# EAGLE design stopwatch (EAGLE 9.1.3)

## Sheet 1 of 8
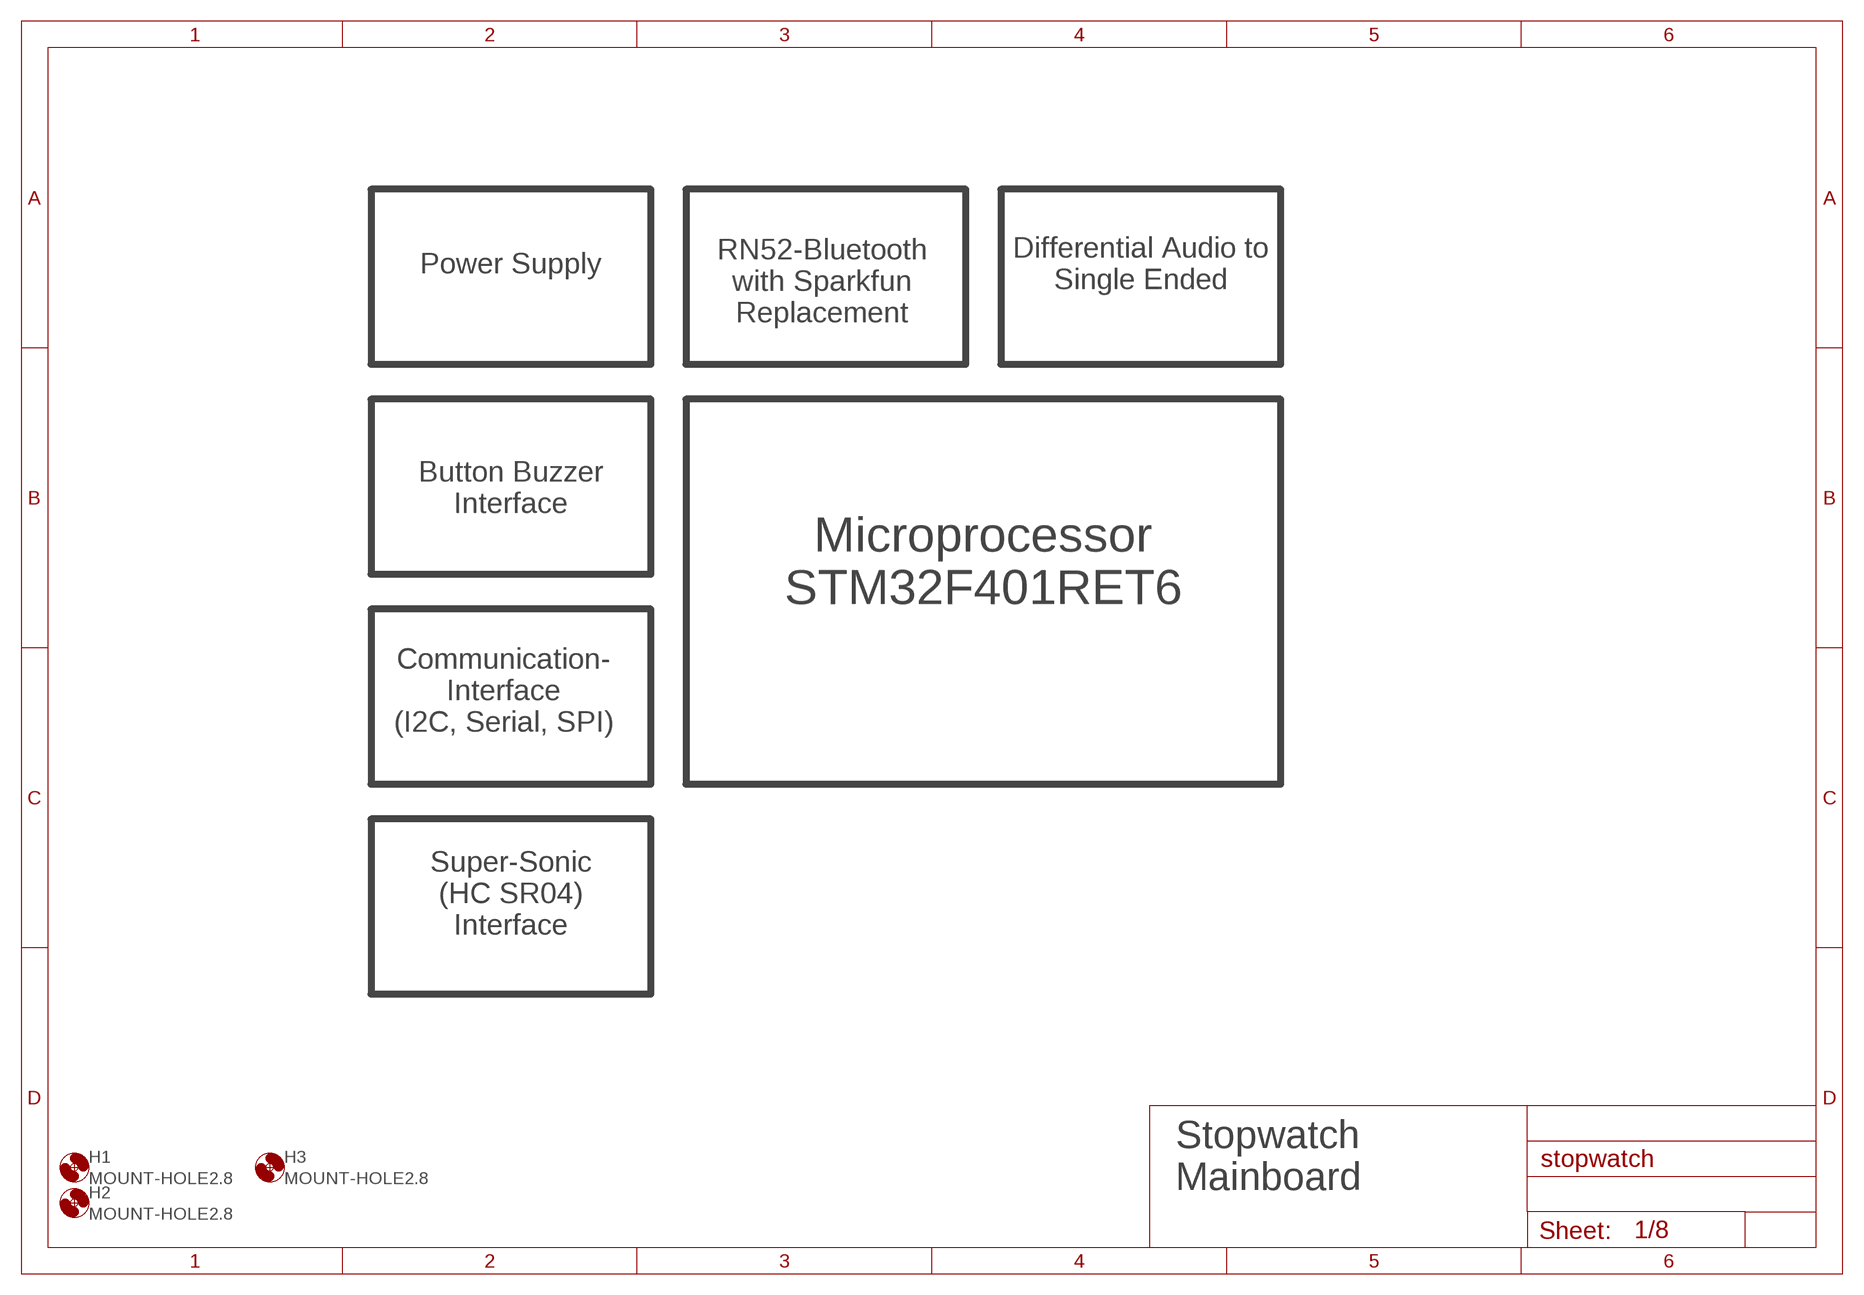
[diagram p0: schematic, sheet 1]

### Parts
H1  MOUNT-HOLE2.8  [2,8]
H2  MOUNT-HOLE2.8  [2,8]
H3  MOUNT-HOLE2.8  [2,8]

### Notes on the sheet
- Power Supply
- Differential Audio to
  Single Ended
- RN52-Bluetooth
  with Sparkfun
  Replacement
- Button Buzzer
  Interface
- Microprocessor
  STM32F401RET6
- Communication-
  Interface
  (I2C, Serial, SPI)
- Super-Sonic
  (HC SR04)
  Interface
- Stopwatch
  Mainboard

## Sheet 2 of 8
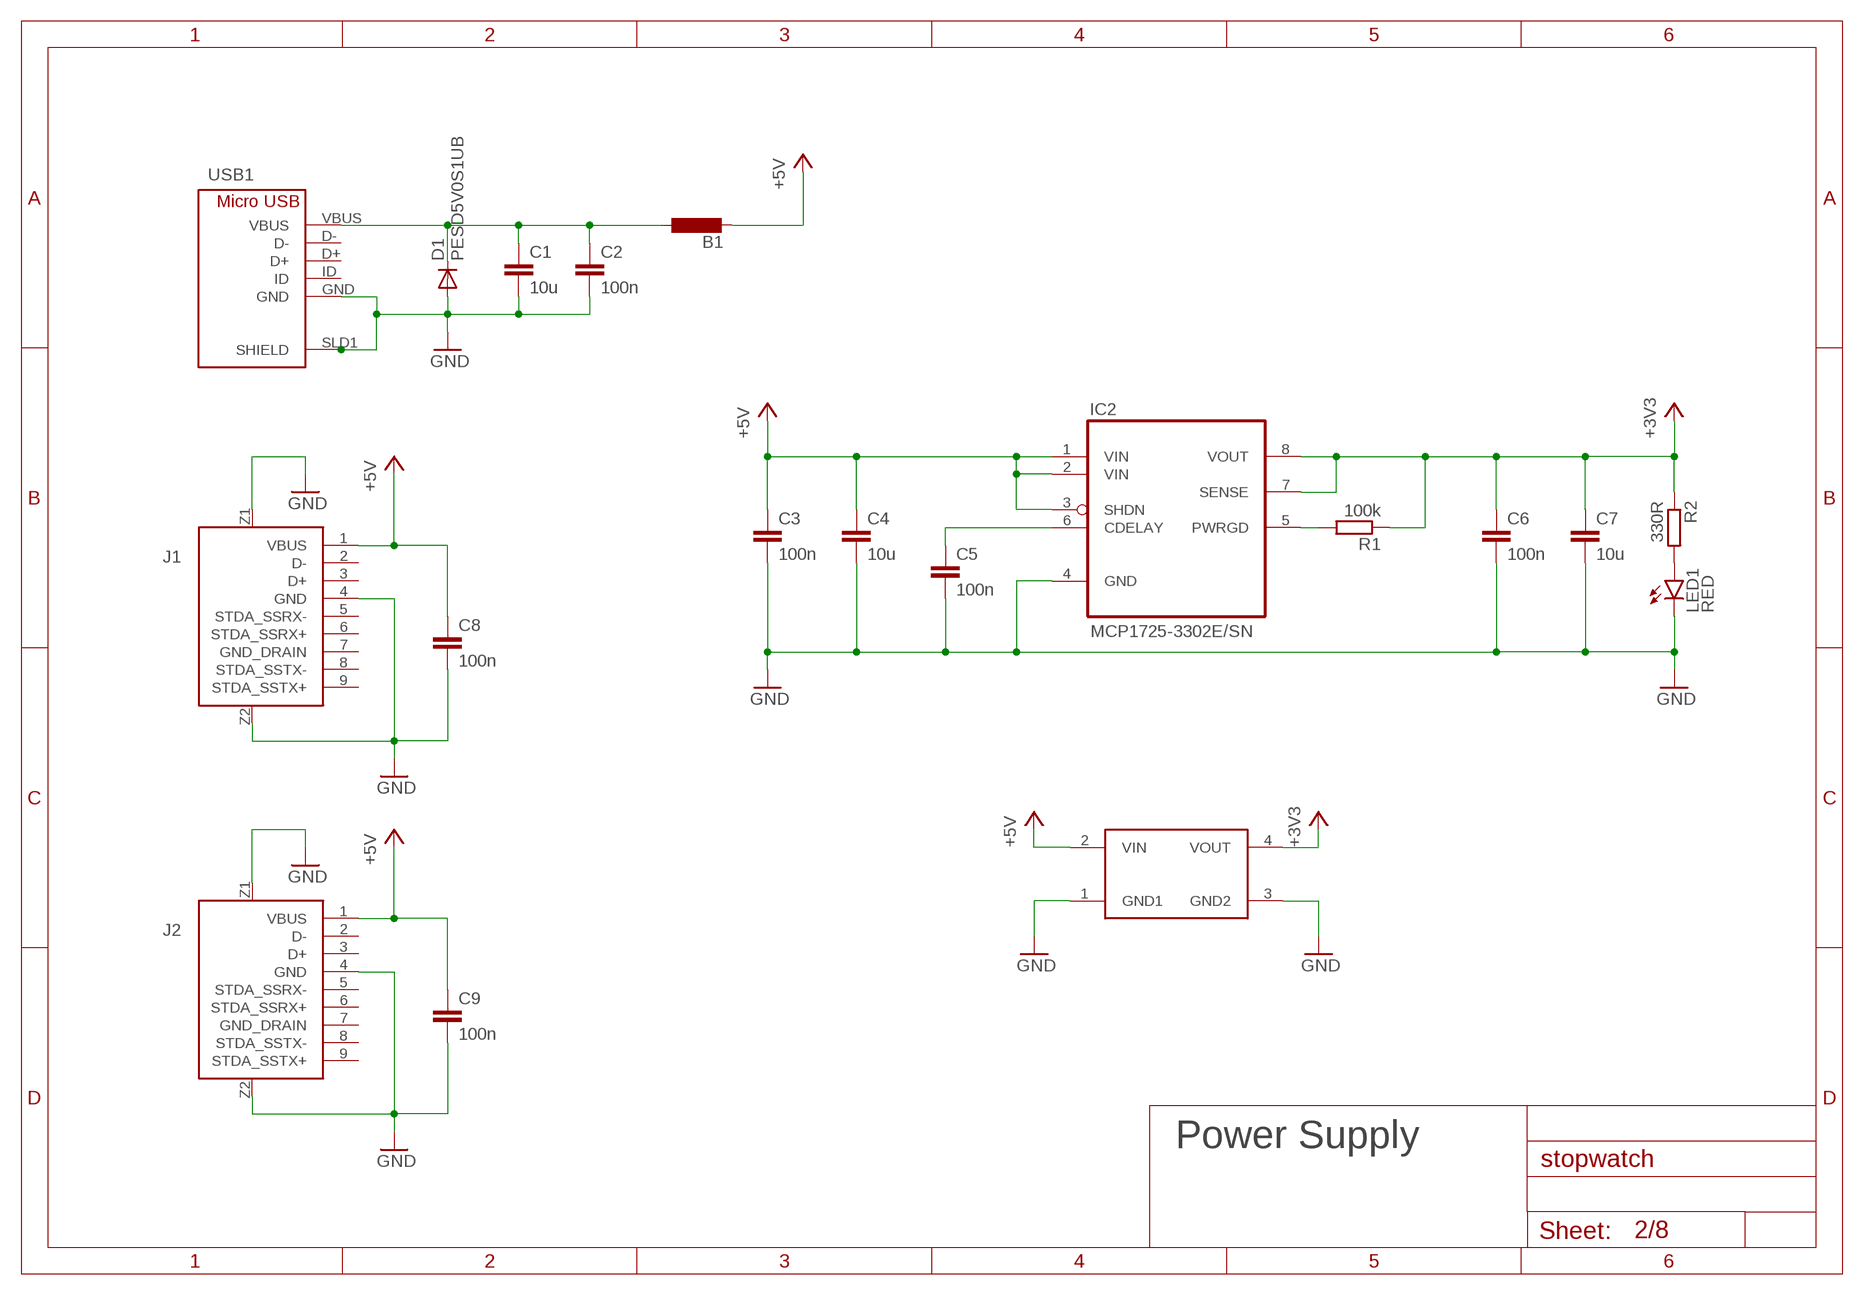
[diagram p1: schematic, sheet 2]

### Parts
B1  B-EU_B0805  [L0805]
C1  10u  C-EUC1206  [C1206]
C2  100n  C-EUC1206  [C1206]
C3  100n  C-EUC1206  [C1206]
C4  10u  C-EUC1206  [C1206]
C5  100n  C-EUC1206  [C1206]
C6  100n  C-EUC1206  [C1206]
C7  10u  C-EUC1206  [C1206]
C8  100n  C-EUC1206  [C1206]
C9  100n  C-EUC1206  [C1206]
D1  PESD5V0S1UB  DIODE-SOD523  [SOD523]
IC2  MCP1725-3302E/SN  [SOIC127P600X175-8N]
J1  USB-A3-0  [USB3_TYPE_A]
J2  USB-A3-0  [USB3_TYPE_A]
LED1  RED  LEDCHIPLED_1206  [CHIPLED_1206]
R1  100k  R-EU_R1206  [R1206]
R2  330R  R-EU_R1206  [R1206]
U$4  RC-STEP-DOWN  [RC-STEP-DOWN]
USB1  MICRO-USB  [ZX62B5PA]

### Nets
+3V3: C6.1 C7.1 IC2.7(SENSE) IC2.8(VOUT) R1.1 R2.1 U$4.4(VOUT) ; also sheet 3,4,5,6
+5V: B1.2 C3.1 C4.1 C8.1 C9.1 IC2.1(VIN) IC2.2(VIN) IC2.3(SHDN) J1.1(VBUS) J2.1(VBUS) U$4.2(VIN) ; also sheet 5,6,7,8
GND: C1.2 C2.2 C3.2 C4.2 C5.2 C6.2 C7.2 C8.2 C9.2 D1.A IC2.4(GND) J1.4(GND) J1.Z1 J1.Z2 J2.4(GND) J2.Z1 J2.Z2 LED1.C U$4.1(GND1) U$4.3(GND2) USB1.GND USB1.SLD1(SHIELD) USB1.SLD2(SHIELD2) USB1.SLD3(SHIELD3) USB1.SLD4(SHIELD4) USB1.SLD5(SHIELD5) USB1.SLD6(SHIELD6) ; also sheet 3,4,5,6,7,8
N$1: B1.1 C1.1 C2.1 D1.C USB1.VBUS
N$2: C5.1 IC2.6(CDELAY)
N$5: IC2.5(PWRGD) R1.2
N$6: LED1.A R2.2
Unconnected: J1.2(D-) J1.3(D+) J1.5(STDA_SSRX-) J1.6(STDA_SSRX+) J1.7(GND_DRAIN) J1.8(STDA_SSTX-) J1.9(STDA_SSTX+) J2.2(D-) J2.3(D+) J2.5(STDA_SSRX-) J2.6(STDA_SSRX+) J2.7(GND_DRAIN) J2.8(STDA_SSTX-) J2.9(STDA_SSTX+) USB1.D+ USB1.D- USB1.ID

### Notes on the sheet
- Power Supply

## Sheet 3 of 8
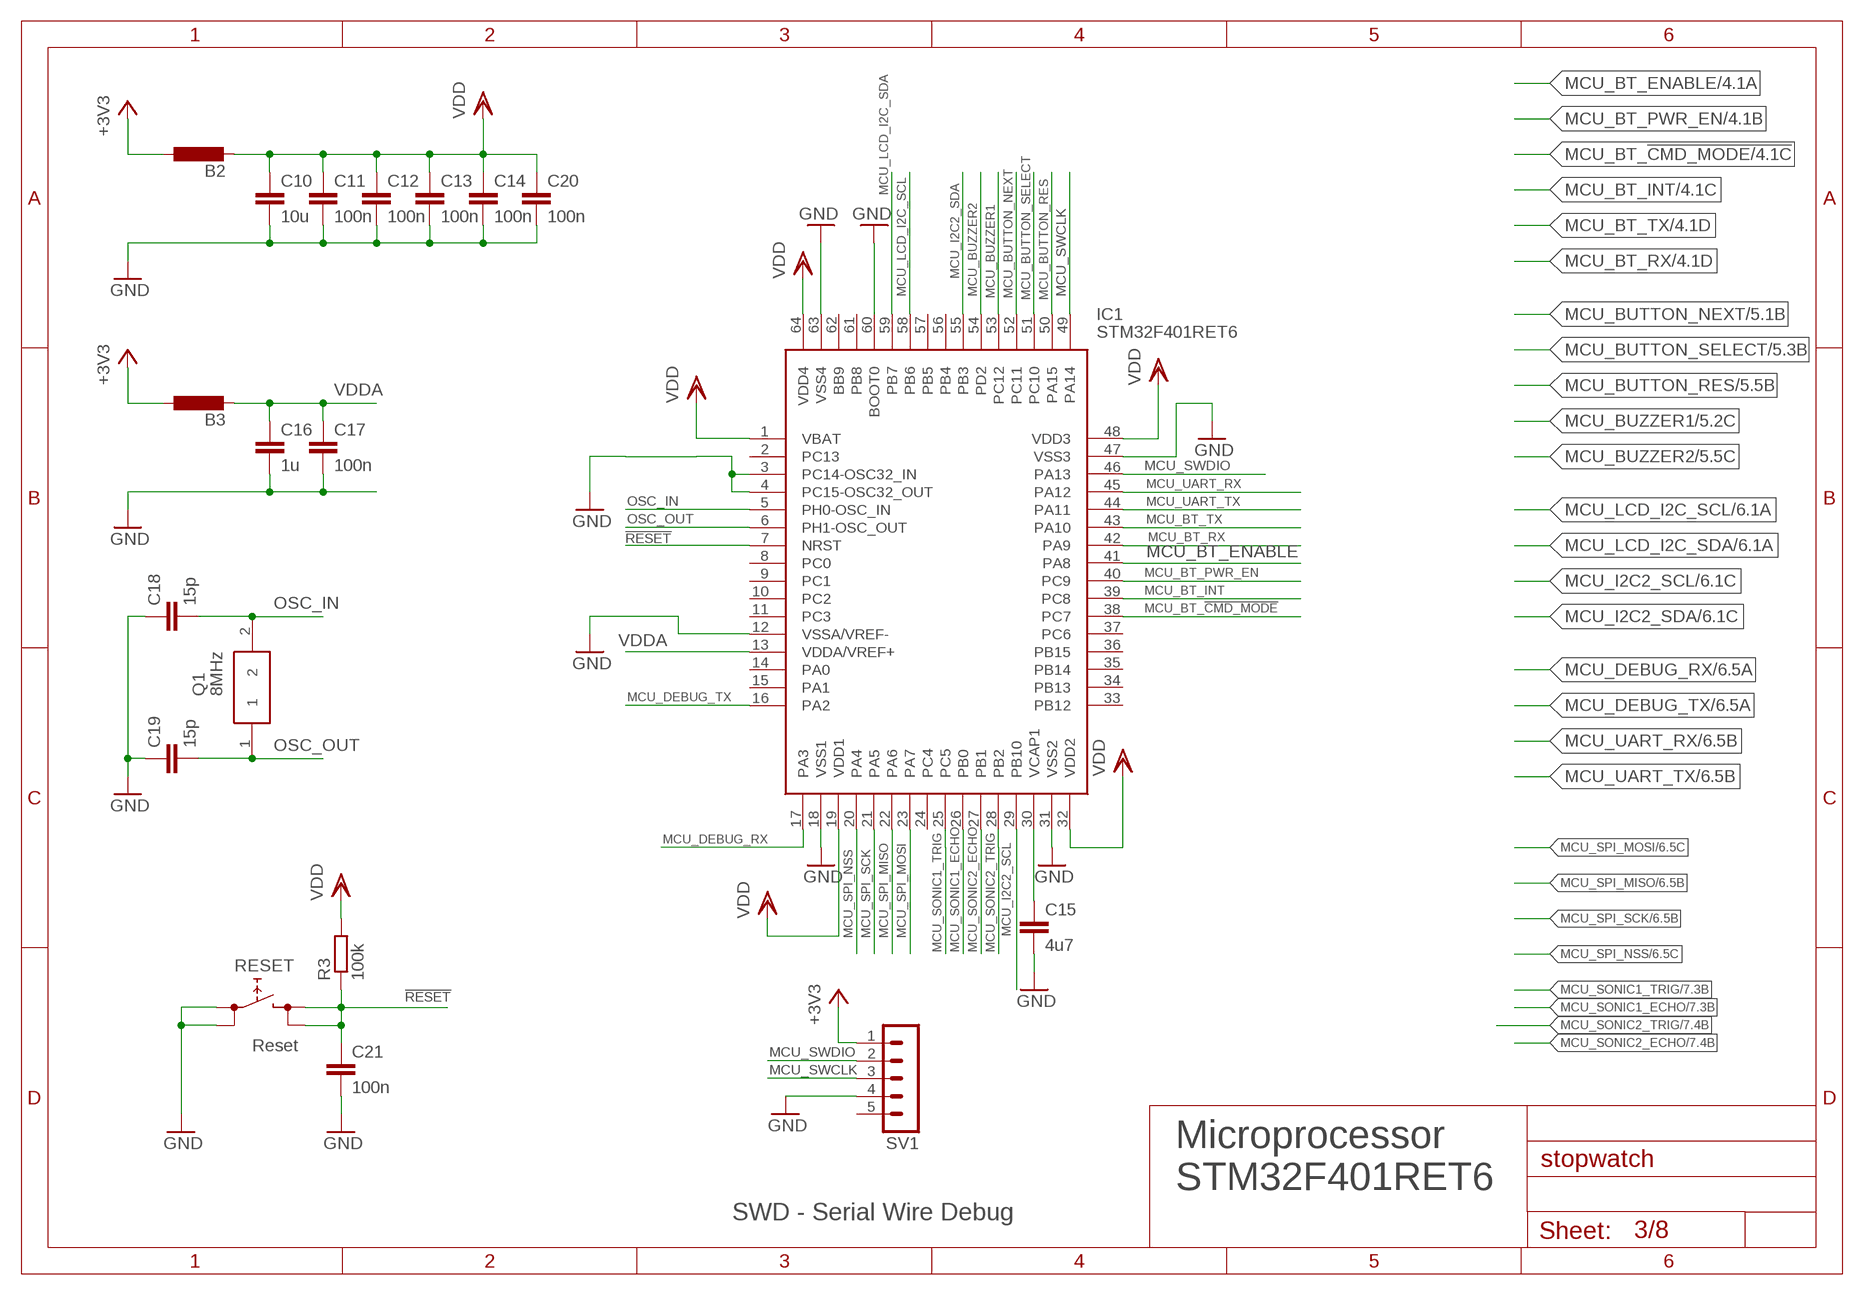
[diagram p2: schematic, sheet 3]

### Parts
B2  B-EU_B0805  [L0805]
B3  B-EU_B0805  [L0805]
C10  10u  C-EUC1206  [C1206]
C11  100n  C-EUC1206  [C1206]
C12  100n  C-EUC1206  [C1206]
C13  100n  C-EUC1206  [C1206]
C14  100n  C-EUC1206  [C1206]
C15  4u7  C-EUC1206  [C1206]
C16  1u  C-EUC1206  [C1206]
C17  100n  C-EUC1206  [C1206]
C18  15p  C-EUC1206  [C1206]
C19  15p  C-EUC1206  [C1206]
C20  100n  C-EUC1206  [C1206]
C21  100n  C-EUC1206  [C1206]
IC1  STM32F401RET6  [QFP50P1200X1200X160-64N]
Q1  8MHz  FOXSDLF_080-20  [FOXSDLF/080-20]
R3  100k  R-EU_R1206  [R1206]
RESET  Reset  TASTER_SMD  [TASTER_SMD_LSG-LSH1301XX]
SV1  MA05-1  [MA05-1]

### Nets
!RESET: C21.1 IC1.7(NRST) R3.1 RESET.3 RESET.4
+3V3: B2.1 B3.1 SV1.1 ; also sheet 2,4,5,6
GND: C10.2 C11.2 C12.2 C13.2 C14.2 C15.2 C16.2 C17.2 C18.1 C19.1 C20.2 C21.2 IC1.3(PC14-OSC32_IN) IC1.4(PC15-OSC32_OUT) IC1.12(VSSA/VREF-) IC1.18(VSS1) IC1.31(VSS2) IC1.47(VSS3) IC1.60(BOOT0) IC1.63(VSS4) RESET.1 RESET.2 SV1.4 ; also sheet 2,4,5,6,7,8
MCU_BT_!CMD_MODE: IC1.38(PC7) ; also sheet 4
MCU_BT_ENABLE: IC1.41(PA8) ; also sheet 4
MCU_BT_INT: IC1.39(PC8) ; also sheet 4
MCU_BT_PWR_EN: IC1.40(PC9) ; also sheet 4
MCU_BT_RX: IC1.42(PA9) ; also sheet 4
MCU_BT_TX: IC1.43(PA10) ; also sheet 4
MCU_BUTTON_NEXT: IC1.52(PC11) ; also sheet 5
MCU_BUTTON_RES: IC1.50(PA15) ; also sheet 5
MCU_BUTTON_SELECT: IC1.51(PC10) ; also sheet 5
MCU_BUZZER1: IC1.53(PC12) ; also sheet 5
MCU_BUZZER2: IC1.54(PD2) ; also sheet 5
MCU_DEBUG_RX: IC1.17(PA3) ; also sheet 6
MCU_DEBUG_TX: IC1.16(PA2) ; also sheet 6
MCU_I2C2_SCL: IC1.29(PB10) ; also sheet 6
MCU_I2C2_SDA: IC1.55(PB3) ; also sheet 6
MCU_LCD_I2C_SCL: IC1.58(PB6) ; also sheet 6
MCU_LCD_I2C_SDA: IC1.59(PB7) ; also sheet 6
MCU_SONIC1_ECHO: IC1.26(PB0) ; also sheet 7
MCU_SONIC1_TRIG: IC1.25(PC5) ; also sheet 7
MCU_SONIC2_ECHO: IC1.27(PB1) ; also sheet 7
MCU_SONIC2_TRIG: IC1.28(PB2) ; also sheet 7
MCU_SPI_MISO: IC1.22(PA6) ; also sheet 6
MCU_SPI_MOSI: IC1.23(PA7) ; also sheet 6
MCU_SPI_NSS: IC1.20(PA4) ; also sheet 6
MCU_SPI_SCK: IC1.21(PA5) ; also sheet 6
MCU_SWCLK: IC1.49(PA14) SV1.3
MCU_SWDIO: IC1.46(PA13) SV1.2
MCU_UART_RX: IC1.45(PA12) ; also sheet 6
MCU_UART_TX: IC1.44(PA11) ; also sheet 6
N$3: C15.1 IC1.30(VCAP1)
OSC_IN: C18.2 IC1.5(PH0-OSC_IN) Q1.2
OSC_OUT: C19.2 IC1.6(PH1-OSC_OUT) Q1.1
VDD: B2.2 C10.1 C11.1 C12.1 C13.1 C14.1 C20.1 IC1.1(VBAT) IC1.19(VDD1) IC1.32(VDD2) IC1.48(VDD3) IC1.64(VDD4) R3.2
VDDA: B3.2 C16.1 C17.1 IC1.13(VDDA/VREF+)
Unconnected: IC1.2(PC13) IC1.8(PC0) IC1.9(PC1) IC1.10(PC2) IC1.11(PC3) IC1.14(PA0) IC1.15(PA1) IC1.24(PC4) IC1.33(PB12) IC1.34(PB13) IC1.35(PB14) IC1.36(PB15) IC1.37(PC6) IC1.56(PB4) IC1.57(PB5) IC1.61(PB8) IC1.62(BB9) SV1.5

### Notes on the sheet
- Microprocessor
  STM32F401RET6
- SWD - Serial Wire Debug

## Sheet 4 of 8
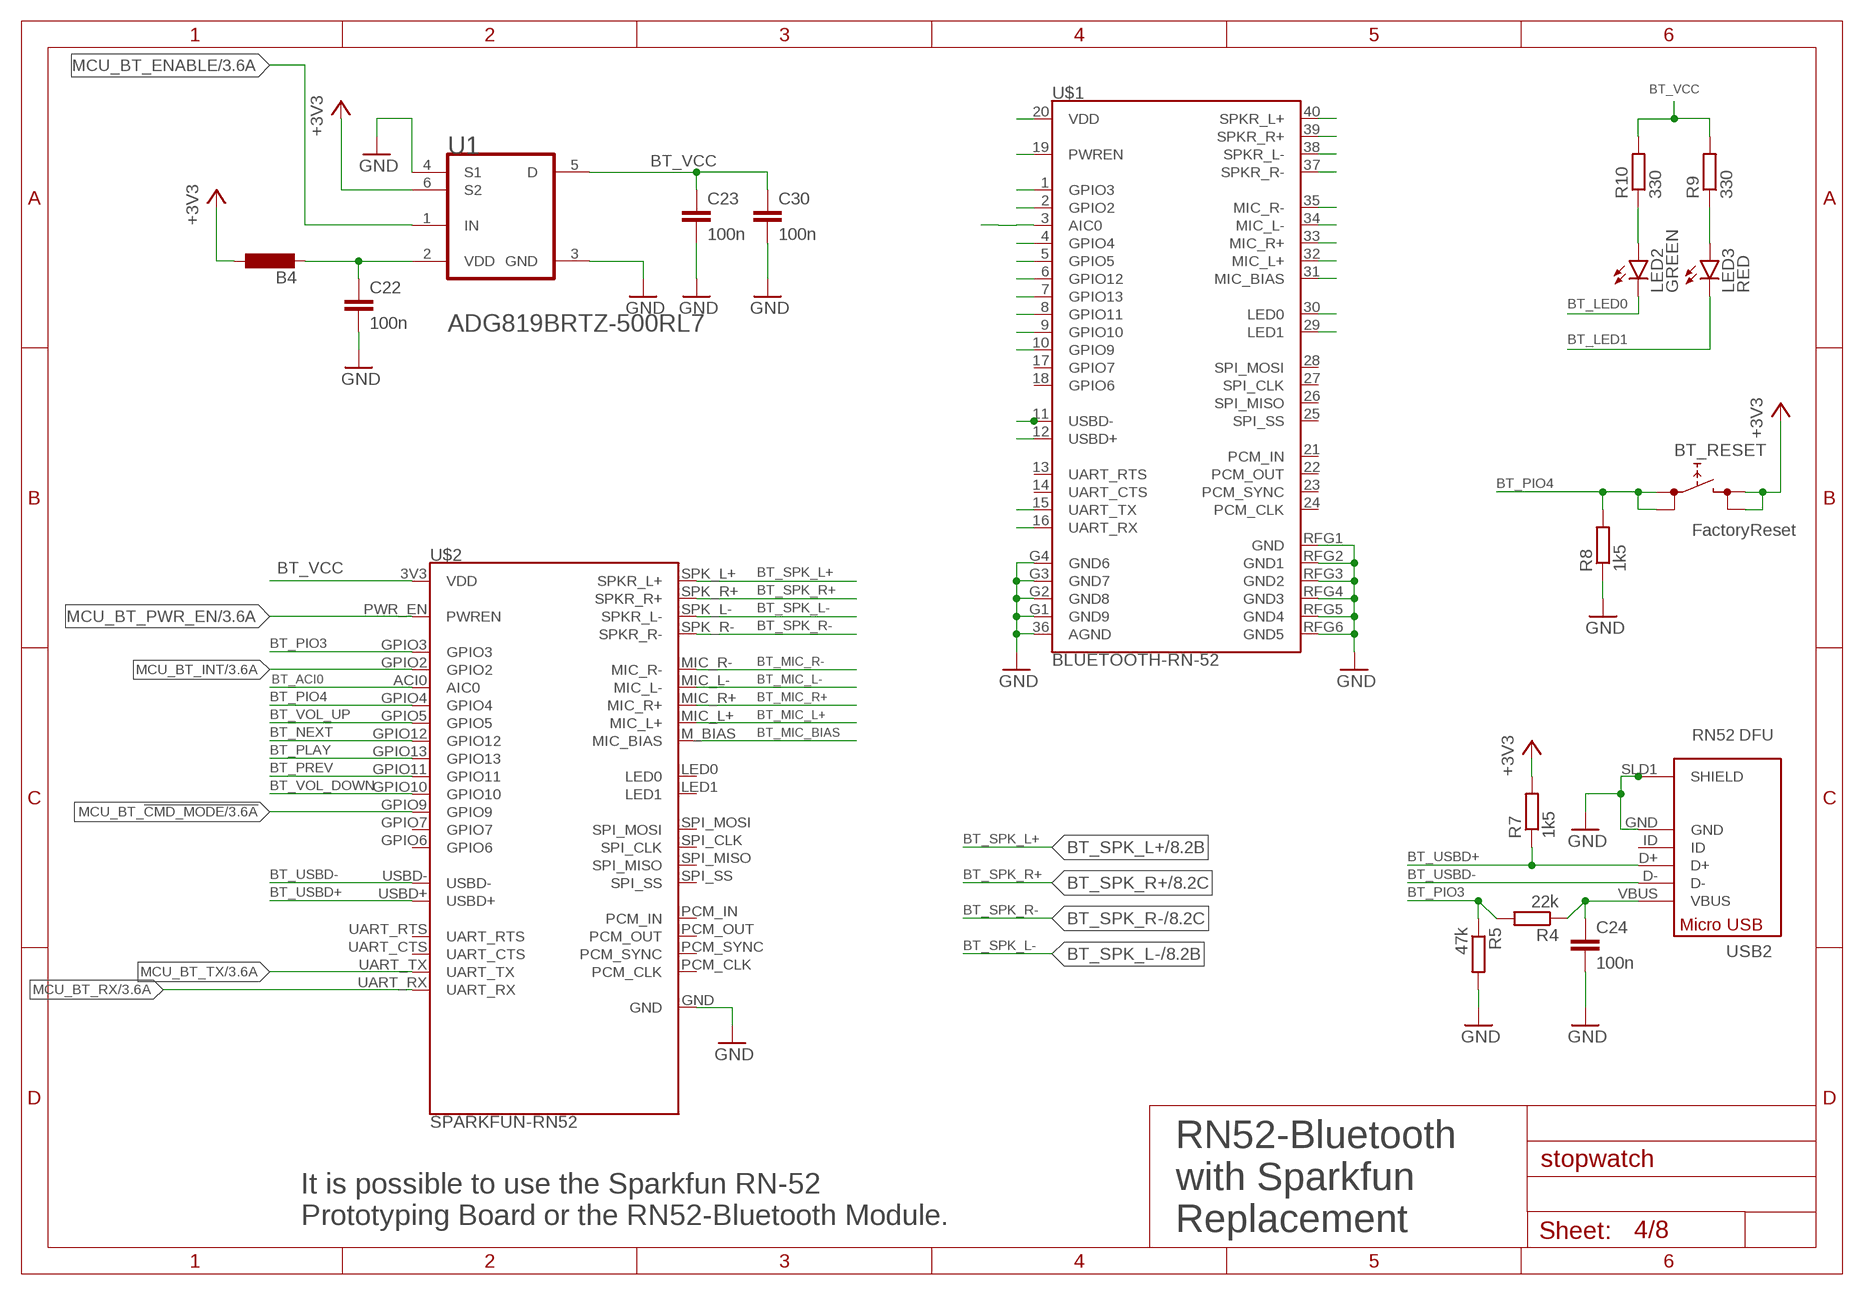
[diagram p3: schematic, sheet 4]

### Parts
B4  B-EU_B0805  [L0805]
BT_RESET  FactoryReset  TASTER_SMD  [TASTER_SMD_LSG-LSH1301XX]
C22  100n  C-EUC1206  [C1206]
C23  100n  C-EUC1206  [C1206]
C24  100n  C-EUC1206  [C1206]
C30  100n  C-EUC1206  [C1206]
LED2  GREEN  LEDCHIPLED_1206  [CHIPLED_1206]
LED3  RED  LEDCHIPLED_1206  [CHIPLED_1206]
R4  22k  R-EU_R1206  [R1206]
R5  47k  R-EU_R1206  [R1206]
R7  1k5  R-EU_R1206  [R1206]
R8  1k5  R-EU_R1206  [R1206]
R9  330  R-EU_R1206  [R1206]
R10  330  R-EU_R1206  [R1206]
U1  ANALOG_DEVICES_ADG819BRTZ-500RL7ANALOG_DEVICES_ADG819BRTZ-500RL7_0_1  [ANALOG_DEVICES_ADG819BRTZ-500RL7_1]
U$1  BLUETOOTH-RN-52  [RN-52]
U$2  SPARKFUN-RN52  [SPARKFUN-RN52]
USB2  MICRO-USB  [ZX62B5PA]

### Nets
+3V3: B4.1 BT_RESET.3 BT_RESET.4 R7.2 U1.6(S2) ; also sheet 2,3,5,6
BT_ACI0: U$1.3(AIC0) U$2.ACI0(AIC0)
BT_LED0: LED2.C U$1.30(LED0)
BT_LED1: LED3.C U$1.29(LED1)
BT_MIC_BIAS: U$1.31(MIC_BIAS) U$2.M_BIAS(MIC_BIAS)
BT_MIC_L+: U$1.32(MIC_L+) U$2.MIC_L+
BT_MIC_L-: U$1.34(MIC_L-) U$2.MIC_L-
BT_MIC_R+: U$1.33(MIC_R+) U$2.MIC_R+
BT_MIC_R-: U$1.35(MIC_R-) U$2.MIC_R-
BT_NEXT: U$1.6(GPIO12) U$2.GPIO12
BT_PIO3: R4.2 R5.1 U$1.1(GPIO3) U$2.GPIO3
BT_PIO4: BT_RESET.1 BT_RESET.2 R8.2 U$1.4(GPIO4) U$2.GPIO4
BT_PLAY: U$1.7(GPIO13) U$2.GPIO13
BT_PREV: U$1.8(GPIO11) U$2.GPIO11
BT_SPK_L+: U$1.40(SPKR_L+) U$2.SPK_L+(SPKR_L+) ; also sheet 8
BT_SPK_L-: U$1.38(SPKR_L-) U$2.SPK_L-(SPKR_L-) ; also sheet 8
BT_SPK_R+: U$1.39(SPKR_R+) U$2.SPK_R+(SPKR_R+) ; also sheet 8
BT_SPK_R-: U$1.37(SPKR_R-) U$2.SPK_R-(SPKR_R-) ; also sheet 8
BT_USBD+: R7.1 U$1.12(USBD+) U$2.USBD+ USB2.D+
BT_USBD-: U$1.11(USBD-) U$2.USBD- USB2.D-
BT_VCC: C23.1 C30.1 R9.2 R10.2 U1.5(D) U$1.20(VDD) U$2.3V3(VDD)
BT_VOL_DOWN: U$1.9(GPIO10) U$2.GPIO10
BT_VOL_UP: U$1.5(GPIO5) U$2.GPIO5
GND: C22.2 C23.2 C24.2 C30.2 R5.2 R8.1 U1.3(GND) U1.4(S1) U$1.36(AGND) U$1.G1(GND9) U$1.G2(GND8) U$1.G3(GND7) U$1.G4(GND6) U$1.RFG1(GND) U$1.RFG2(GND1) U$1.RFG3(GND2) U$1.RFG4(GND3) U$1.RFG5(GND4) U$1.RFG6(GND5) U$2.GND USB2.GND USB2.SLD1(SHIELD) USB2.SLD2(SHIELD2) USB2.SLD3(SHIELD3) USB2.SLD4(SHIELD4) USB2.SLD5(SHIELD5) USB2.SLD6(SHIELD6) ; also sheet 2,3,5,6,7,8
MCU_BT_!CMD_MODE: U$1.10(GPIO9) U$2.GPIO9 ; also sheet 3
MCU_BT_ENABLE: U1.1(IN) ; also sheet 3
MCU_BT_INT: U$1.2(GPIO2) U$2.GPIO2 ; also sheet 3
MCU_BT_PWR_EN: U$1.19(PWREN) U$2.PWR_EN(PWREN) ; also sheet 3
MCU_BT_RX: U$1.16(UART_RX) U$2.UART_RX ; also sheet 3
MCU_BT_TX: U$1.15(UART_TX) U$2.UART_TX ; also sheet 3
N$4: B4.2 C22.1 U1.2(VDD)
N$7: C24.1 R4.1 USB2.VBUS
N$11: LED2.A R10.1
N$13: LED3.A R9.1
Unconnected: U$1.13(UART_RTS) U$1.14(UART_CTS) U$1.17(GPIO7) U$1.18(GPIO6) U$1.21(PCM_IN) U$1.22(PCM_OUT) U$1.23(PCM_SYNC) U$1.24(PCM_CLK) U$1.25(SPI_SS) U$1.26(SPI_MISO) U$1.27(SPI_CLK) U$1.28(SPI_MOSI) U$2.GPIO6 U$2.GPIO7 U$2.LED0 U$2.LED1 U$2.PCM_CLK U$2.PCM_IN U$2.PCM_OUT U$2.PCM_SYNC U$2.SPI_CLK U$2.SPI_MISO U$2.SPI_MOSI U$2.SPI_SS U$2.UART_CTS U$2.UART_RTS USB2.ID

### Notes on the sheet
- RN52 DFU
- RN52-Bluetooth
  with Sparkfun
  Replacement
- It is possible to use the Sparkfun RN-52
  Prototyping Board or the RN52-Bluetooth Module.

## Sheet 5 of 8
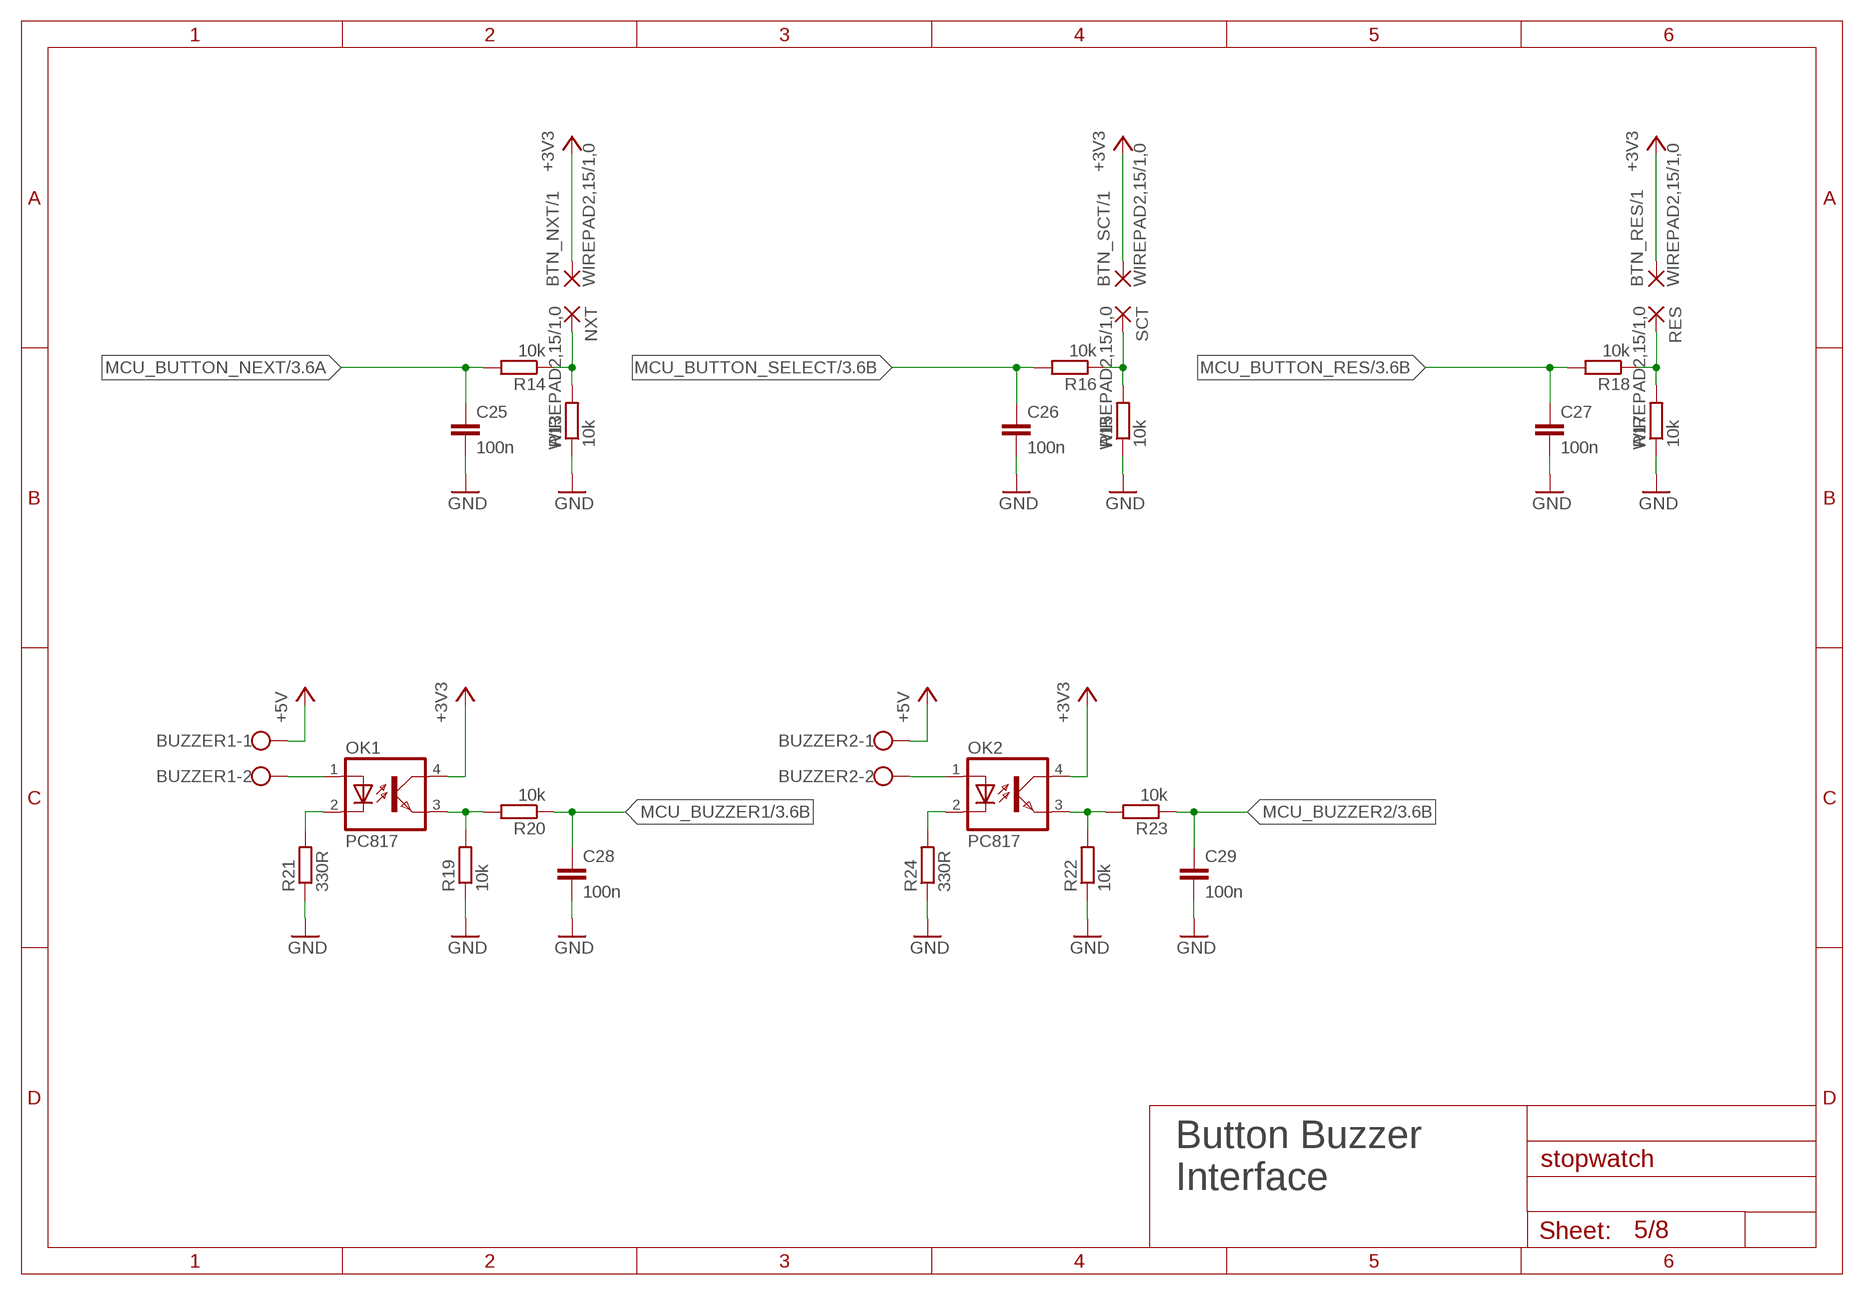
[diagram p4: schematic, sheet 5]

### Parts
BTN_NXT/1  WIREPAD2,15/1,0  [2,15/1,0]
BTN_RES/1  WIREPAD2,15/1,0  [2,15/1,0]
BTN_SCT/1  WIREPAD2,15/1,0  [2,15/1,0]
BUZZER1  W237-102  [W237-102]
BUZZER2  W237-102  [W237-102]
C25  100n  C-EUC1206  [C1206]
C26  100n  C-EUC1206  [C1206]
C27  100n  C-EUC1206  [C1206]
C28  100n  C-EUC1206  [C1206]
C29  100n  C-EUC1206  [C1206]
NXT  WIREPAD2,15/1,0  [2,15/1,0]
OK1  PC817  [DIL04]
OK2  PC817  [DIL04]
R13  10k  R-EU_R1206  [R1206]
R14  10k  R-EU_R1206  [R1206]
R15  10k  R-EU_R1206  [R1206]
R16  10k  R-EU_R1206  [R1206]
R17  10k  R-EU_R1206  [R1206]
R18  10k  R-EU_R1206  [R1206]
R19  10k  R-EU_R1206  [R1206]
R20  10k  R-EU_R1206  [R1206]
R21  330R  R-EU_R1206  [R1206]
R22  10k  R-EU_R1206  [R1206]
R23  10k  R-EU_R1206  [R1206]
R24  330R  R-EU_R1206  [R1206]
RES  WIREPAD2,15/1,0  [2,15/1,0]
SCT  WIREPAD2,15/1,0  [2,15/1,0]

### Nets
+3V3: BTN_NXT/1.1(P) BTN_RES/1.1(P) BTN_SCT/1.1(P) OK1.4(COL) OK2.4(COL) ; also sheet 2,3,4,6
+5V: BUZZER1.1 BUZZER2.1 ; also sheet 2,6,7,8
GND: C25.2 C26.2 C27.2 C28.2 C29.2 R13.1 R15.1 R17.1 R19.1 R21.1 R22.1 R24.1 ; also sheet 2,3,4,6,7,8
MCU_BUTTON_NEXT: C25.1 R14.2 ; also sheet 3
MCU_BUTTON_RES: C27.1 R18.2 ; also sheet 3
MCU_BUTTON_SELECT: C26.1 R16.2 ; also sheet 3
MCU_BUZZER1: C28.1 R20.1 ; also sheet 3
MCU_BUZZER2: C29.1 R23.1 ; also sheet 3
N$9: NXT.1(P) R13.2 R14.1
N$10: R15.2 R16.1 SCT.1(P)
N$14: R17.2 R18.1 RES.1(P)
N$15: BUZZER1.2 OK1.1(A)
N$16: OK1.2(C) R21.2
N$17: OK1.3(EMIT) R19.2 R20.2
N$18: BUZZER2.2 OK2.1(A)
N$19: OK2.2(C) R24.2
N$20: OK2.3(EMIT) R22.2 R23.2

### Notes on the sheet
- Button Buzzer
  Interface

## Sheet 6 of 8
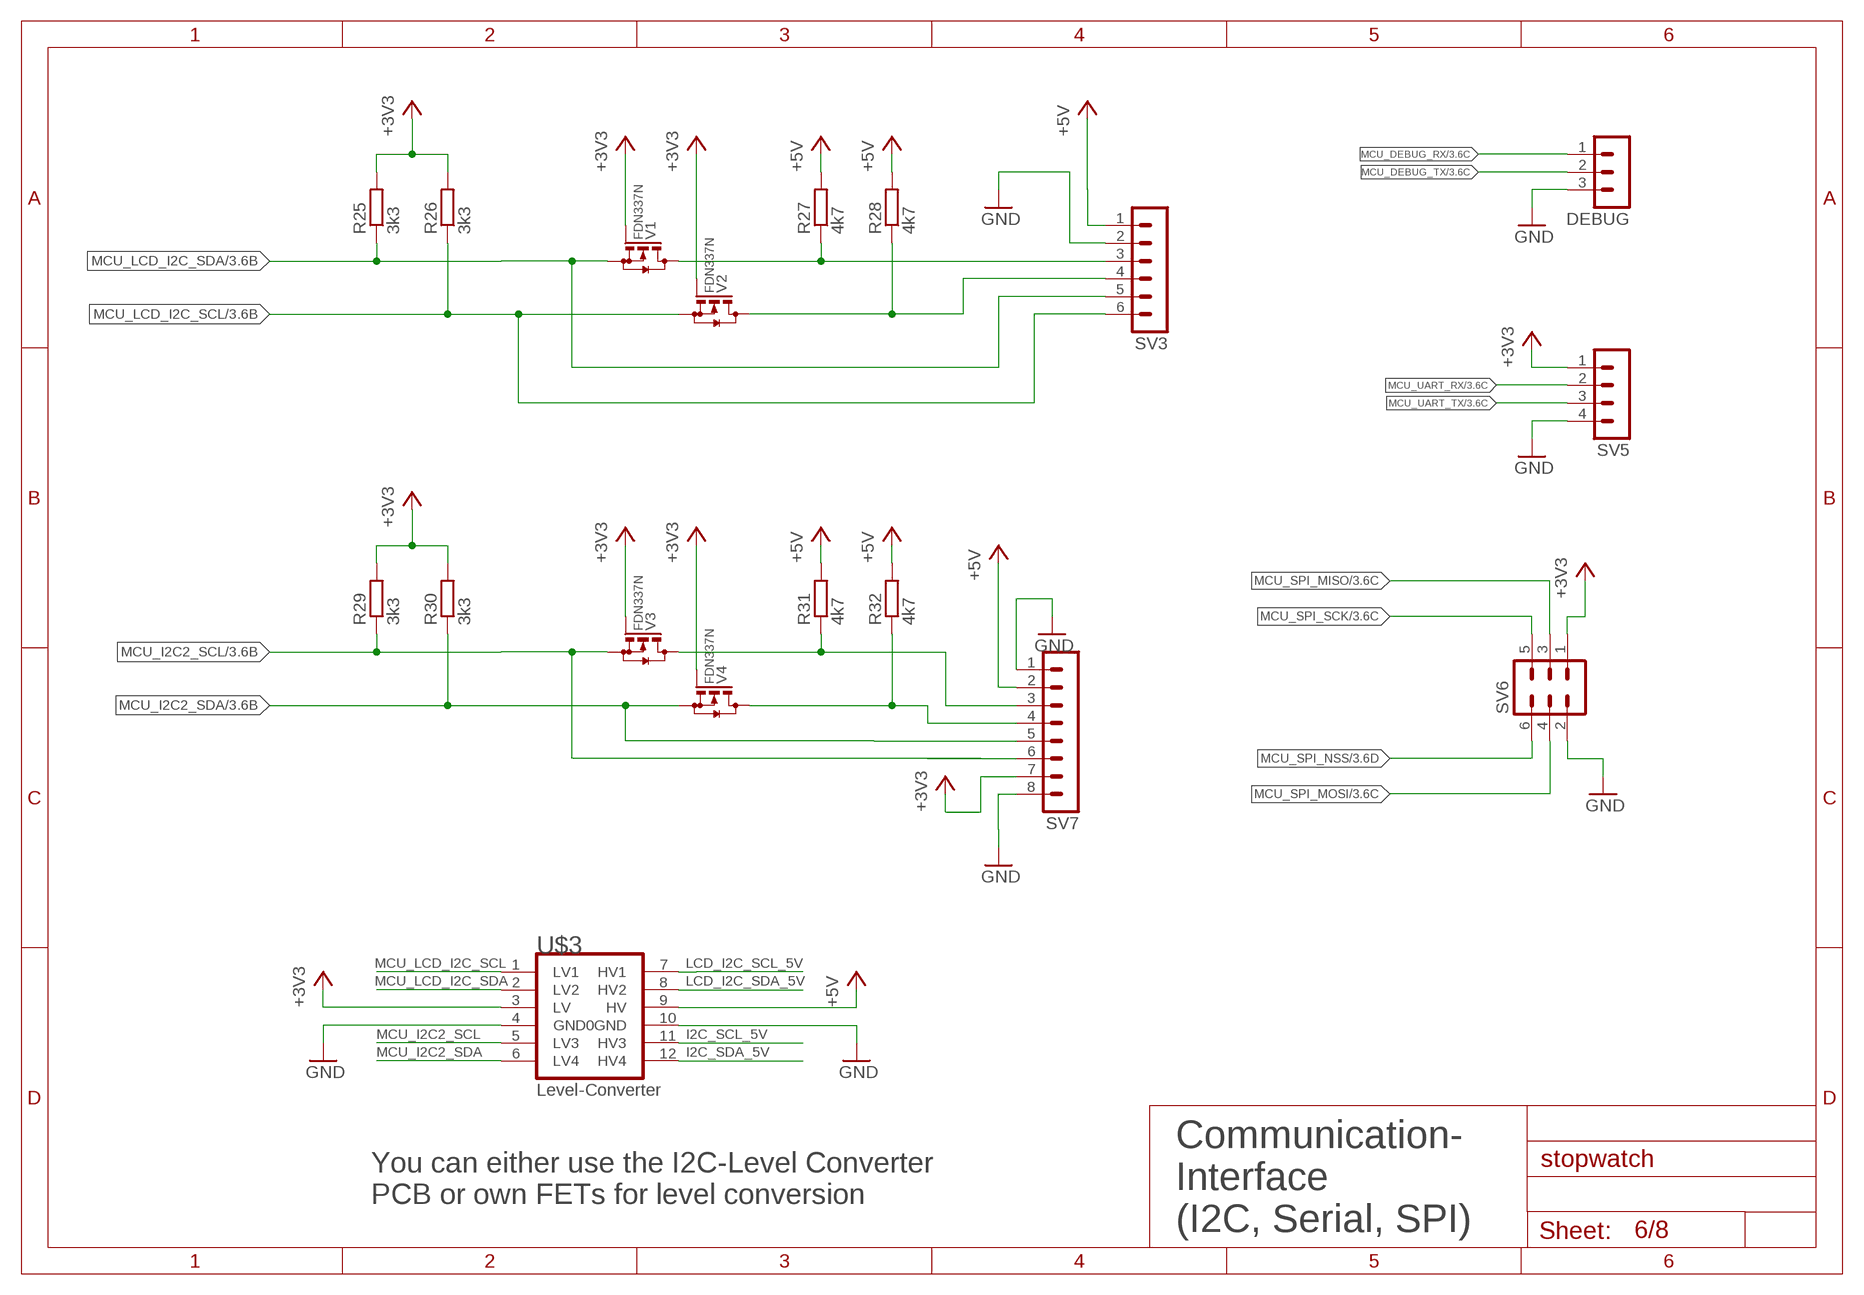
[diagram p5: schematic, sheet 6]

### Parts
DEBUG  MA03-1  [MA03-1]
R25  3k3  R-EU_R1206  [R1206]
R26  3k3  R-EU_R1206  [R1206]
R27  4k7  R-EU_R1206  [R1206]
R28  4k7  R-EU_R1206  [R1206]
R29  3k3  R-EU_R1206  [R1206]
R30  3k3  R-EU_R1206  [R1206]
R31  4k7  R-EU_R1206  [R1206]
R32  4k7  R-EU_R1206  [R1206]
SV3  MA06-1  [MA06-1]
SV5  MA04-1  [MA04-1]
SV6  MA03-2  [MA03-2]
SV7  MA08-1  [MA08-1]
U$3  I2C-LEVELCONVERTER-PCB  [I2C-LEVELCONVERTER-PCB]
V1  FDN337N  [SOT23]
V2  FDN337N  [SOT23]
V3  FDN337N  [SOT23]
V4  FDN337N  [SOT23]

### Nets
+3V3: R25.2 R26.2 R29.2 R30.2 SV5.1 SV6.1 SV7.7 U$3.3(LV) V1.1(G) V2.1(G) V3.1(G) V4.1(G) ; also sheet 2,3,4,5
+5V: R27.2 R28.2 R31.2 R32.2 SV3.1 SV7.2 U$3.9(HV) ; also sheet 2,5,7,8
GND: DEBUG.3 SV3.2 SV5.4 SV6.2 SV7.1 SV7.8 U$3.4(GND0) U$3.10(GND) ; also sheet 2,3,4,5,7,8
I2C_SCL_5V: R31.1 SV7.3 U$3.11(HV3) V3.3(D)
I2C_SDA_5V: R32.1 SV7.4 U$3.12(HV4) V4.3(D)
LCD_I2C_SCL_5V: R28.1 SV3.4 U$3.7(HV1) V2.3(D)
LCD_I2C_SDA_5V: R27.1 SV3.3 U$3.8(HV2) V1.3(D)
MCU_DEBUG_RX: DEBUG.1 ; also sheet 3
MCU_DEBUG_TX: DEBUG.2 ; also sheet 3
MCU_I2C2_SCL: R29.1 SV7.6 U$3.5(LV3) V3.2(S) ; also sheet 3
MCU_I2C2_SDA: R30.1 SV7.5 U$3.6(LV4) V4.2(S) ; also sheet 3
MCU_LCD_I2C_SCL: R26.1 SV3.6 U$3.1(LV1) V2.2(S) ; also sheet 3
MCU_LCD_I2C_SDA: R25.1 SV3.5 U$3.2(LV2) V1.2(S) ; also sheet 3
MCU_SPI_MISO: SV6.3 ; also sheet 3
MCU_SPI_MOSI: SV6.4 ; also sheet 3
MCU_SPI_NSS: SV6.6 ; also sheet 3
MCU_SPI_SCK: SV6.5 ; also sheet 3
MCU_UART_RX: SV5.2 ; also sheet 3
MCU_UART_TX: SV5.3 ; also sheet 3

### Notes on the sheet
- Communication-
  Interface
  (I2C, Serial, SPI)
- You can either use the I2C-Level Converter
  PCB or own FETs for level conversion

## Sheet 7 of 8
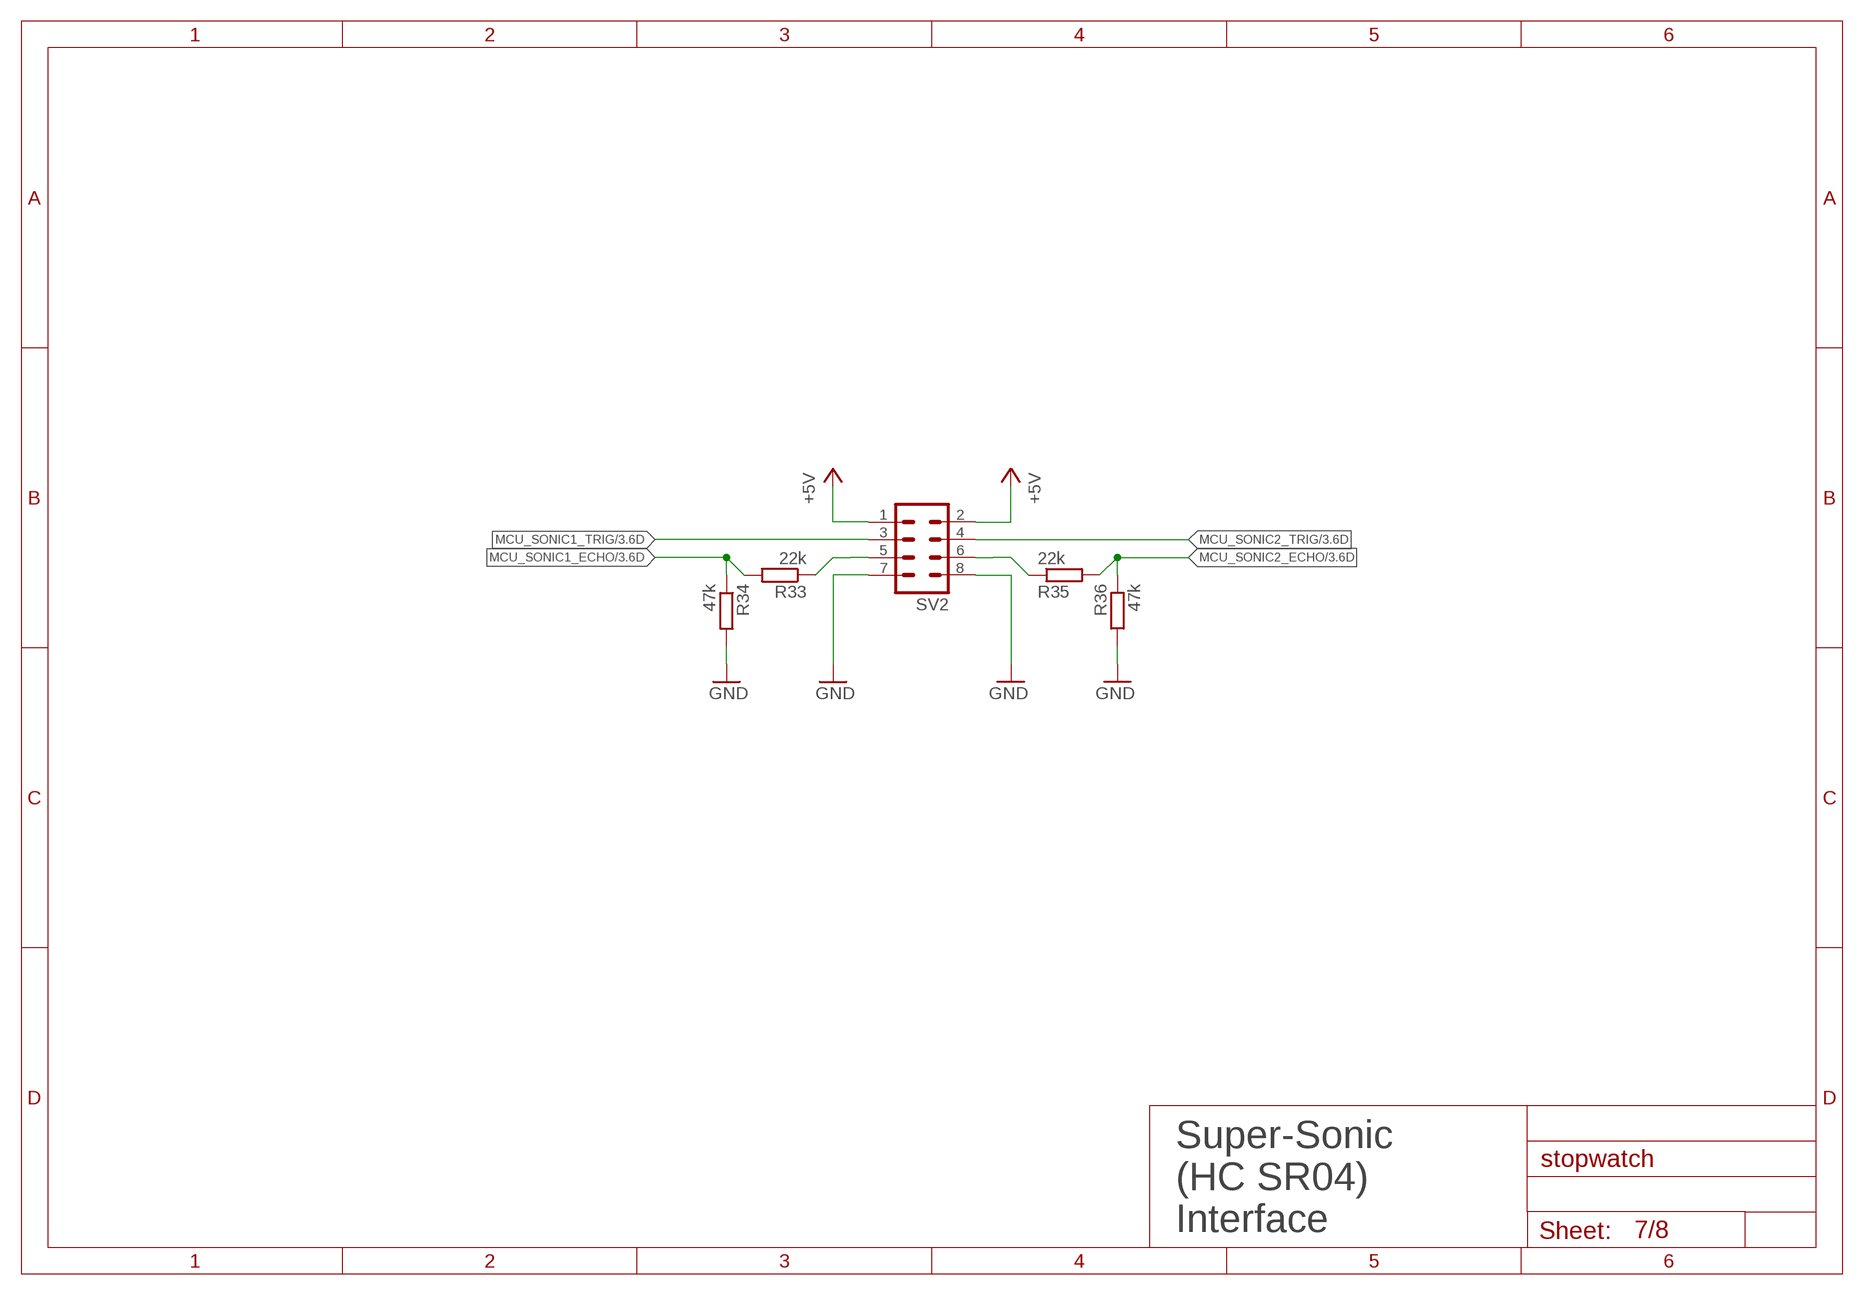
[diagram p6: schematic, sheet 7]

### Parts
R33  22k  R-EU_R1206  [R1206]
R34  47k  R-EU_R1206  [R1206]
R35  22k  R-EU_R1206  [R1206]
R36  47k  R-EU_R1206  [R1206]
SV2  MA04-2  [MA04-2]

### Nets
+5V: SV2.1 SV2.2 ; also sheet 2,5,6,8
GND: R34.2 R36.2 SV2.7 SV2.8 ; also sheet 2,3,4,5,6,8
MCU_SONIC1_ECHO: R33.2 R34.1 ; also sheet 3
MCU_SONIC1_TRIG: SV2.3 ; also sheet 3
MCU_SONIC2_ECHO: R35.2 R36.1 ; also sheet 3
MCU_SONIC2_TRIG: SV2.4 ; also sheet 3
N$21: R35.1 SV2.6
N$22: R33.1 SV2.5

### Notes on the sheet
- Super-Sonic
  (HC SR04)
  Interface

## Sheet 8 of 8
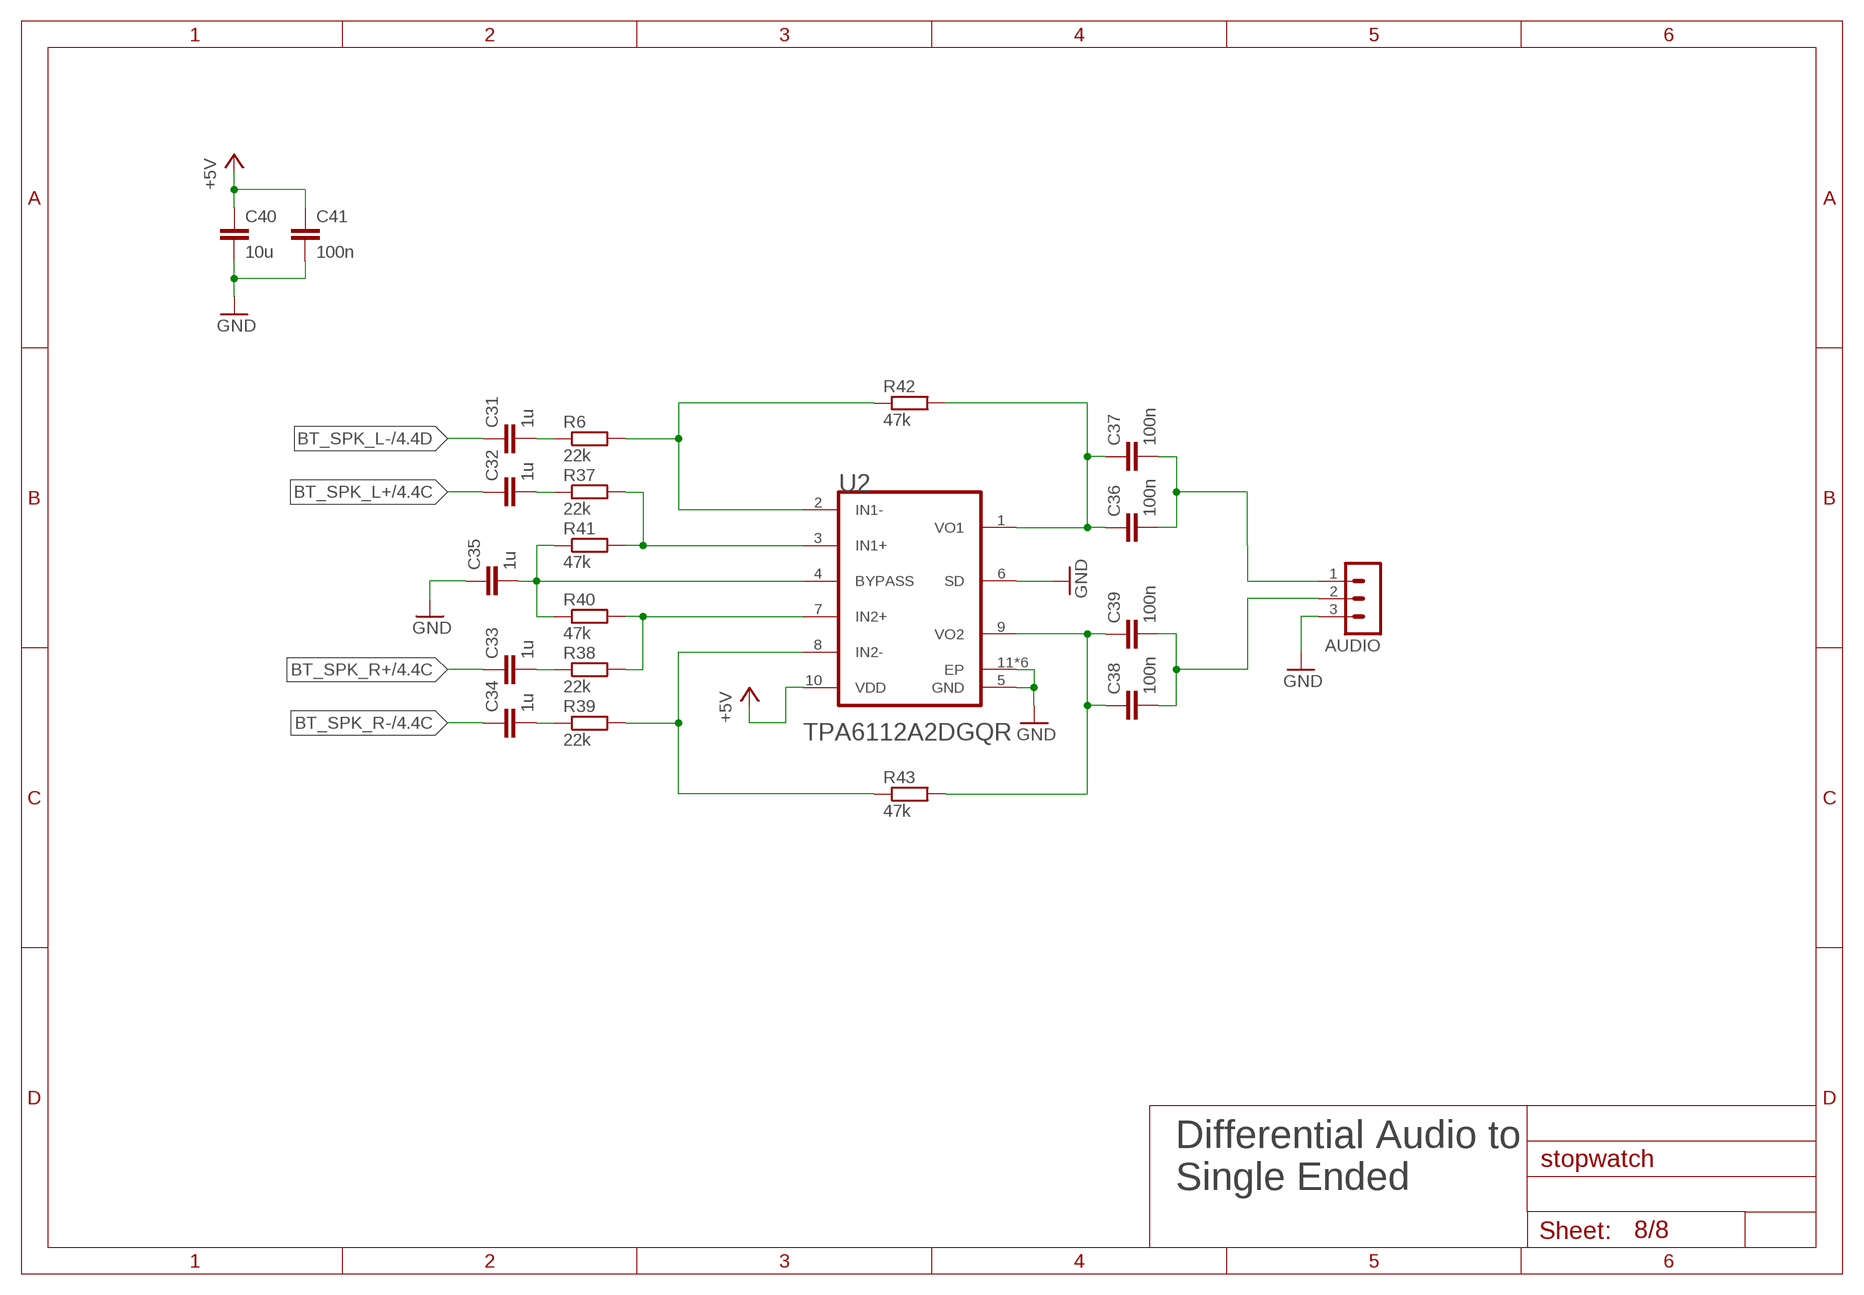
[diagram p7: schematic, sheet 8]

### Parts
AUDIO  MA03-1  [MA03-1]
C31  1u  C-EUC1206  [C1206]
C32  1u  C-EUC1206  [C1206]
C33  1u  C-EUC1206  [C1206]
C34  1u  C-EUC1206  [C1206]
C35  1u  C-EUC1206  [C1206]
C36  100n  C-EUC1206  [C1206]
C37  100n  C-EUC1206  [C1206]
C38  100n  C-EUC1206  [C1206]
C39  100n  C-EUC1206  [C1206]
C40  10u  C-EUC1206  [C1206]
C41  100n  C-EUC1206  [C1206]
R6  22k  R-EU_R1206  [R1206]
R37  22k  R-EU_R1206  [R1206]
R38  22k  R-EU_R1206  [R1206]
R39  22k  R-EU_R1206  [R1206]
R40  47k  R-EU_R1206  [R1206]
R41  47k  R-EU_R1206  [R1206]
R42  47k  R-EU_R1206  [R1206]
R43  47k  R-EU_R1206  [R1206]
U2  TEXAS_INSTRUMENTS_TPA6112A2DGQRTEXAS_INSTRUMENTS_TPA6112A2DGQR_0_1  [TEXAS_INSTRUMENTS_TPA6112A2DGQR_1]

### Nets
+5V: C40.1 C41.1 U2.10(VDD) ; also sheet 2,5,6,7
BT_SPK_L+: C32.1 ; also sheet 4
BT_SPK_L-: C31.1 ; also sheet 4
BT_SPK_R+: C33.1 ; also sheet 4
BT_SPK_R-: C34.1 ; also sheet 4
GND: AUDIO.3 C35.1 C40.2 C41.2 U2.5(GND) U2.6(SD) U2.11(EP) U2.PAD_1(EP) U2.PAD_2(EP) U2.PAD_3(EP) U2.PAD_4(EP) U2.PAD_5(EP) ; also sheet 2,3,4,5,6,7
N$12: R6.2 R42.1 U2.2(IN1-)
N$23: R39.2 R43.1 U2.8(IN2-)
N$25: AUDIO.2 C38.2 C39.2
N$26: C38.1 C39.1 R43.2 U2.9(VO2)
N$27: C36.1 C37.1 R42.2 U2.1(VO1)
N$30: C31.2 R6.1
N$31: C32.2 R37.1
N$32: C33.2 R38.1
N$33: C34.2 R39.1
N$34: R37.2 R41.2 U2.3(IN1+)
N$35: R38.2 R40.2 U2.7(IN2+)
N$36: C35.2 R40.1 R41.1 U2.4(BYPASS)
N$37: AUDIO.1 C36.2 C37.2

### Notes on the sheet
- Differential Audio to
  Single Ended

## Library data of the parts
AUDIO DEBUG = con-lstb:MA03-1: PIN HEADER; OC_FARNELL: unknown; OC_NEWARK: unknown
B1-B4 = stopwatch:B-EU_: EMI Filter
BT_RESET RESET = stopwatch:TASTER_SMD: 6.0 X 6.0mm TACT Switch (SMD) - Schurter Typ LSG/LSH 1301.xx Source: http://www.reichelt.de/TASTER-9315/3/index.html?&ACTION=3&LA=446&ARTICLE=44514&artnr=TASTER+9315&SEARCH=taster+931
BTN_NXT/1 BTN_RES/1 BTN_SCT/1 NXT RES SCT = wirepad:WIREPAD: Wire PAD connect wire on PCB
BUZZER1 BUZZER2 = con-wago-500:W237-102: WAGO SCREW CLAMP; MPN: 237-102; OC_FARNELL: unknown; OC_NEWARK: 70K9898
C1-C41 = rcl:C-EU: CAPACITOR, European symbol; SPICEPREFIX: C
D1 = diode:DIODE-: DIODE
H1-H3 = holes:MOUNT-HOLE: MOUNTING HOLE with drill center marker
IC1 = stopwatch:STM32F401RET6: ARM Cortex-M4 32b MCU+FPU Source: Datasheet <http://uk.rs-online.com/web/p/products/1661154>; DESCRIPTION: ARM Cortex-M4 32b MCU+FPU; HEIGHT: 1.6mm; MANUFACTURER_NAME: STMicroelectronics; MANUFACTURER_PART_NUMBER: STM32F401RET6; RS_PART_NUMBER: 1661154
IC2 = stopwatch:MCP1725-3302E/SN: Low Quiescent Current LDO Regulator; MPN: MCP1725-3302E/SN; OC_FARNELL: 1439383; OC_NEWARK: 58M8879; PACKAGE: SOIC-8; SUPPLIER: Microchip
J1 J2 = stopwatch:USB-A3-0: WR-COM USB 3.0 HORIZONTAL TYPE A=>Code : Con_I-O_COM_USB-3.0_A_629121030100 <http://katalog.we-online.de/media/images/eican/Con_I-O_COM_USB-3.0_A_629121030100_pf2.jpg> Details see: http://katalog.we-online.de/en/em/692_121_030_100 Created 2014-07-09, Karrer Zheng 2014 (C) Würth Elektronik
LED1-LED3 = led:LED: LED OSRAM: - CHIPLED LG R971, LG N971, LY N971, LG Q971, LY Q971, LO R971, LY R971 LH N974, LH R974 LS Q976, LO Q976, LY Q976 LO Q996 - Hyper CHIPLED LW Q18S LB Q993, LB Q99A, LB R99A - SideLED LS A670, LO A670, LY A670, LG A670, LP A670 LB A673, LV A673, LT A673, LW A673 LH A674 LY A675 LS A676, LA A676, LO A676, LY A676, LW A676 LS A679, LY A679, LG A679 - Hyper Micro SIDELED® LS Y876, LA Y876, LO Y876, LY Y876 LT Y87S - SmartLED LW L88C, LW L88S LB L89C, LB L89S, LG L890 LS L89K, LO L89K, LY L89K LS L896, LA L896, LO L896, LY L896 - TOPLED LS T670, LO T670, LY T670, LG T670, LP T670 LSG T670, LSP T670, LSY T670, LOP T670, LYG T670 LG T671, LOG T671, LSG T671 LB T673, LV T673, LT T673, LW T673 LH T674 LS T676, LA T676, LO T676, LY T676, LB T676, LH T676, LSB T676, LW T676 LB T67C, LV T67C, LT T67C, LS T67K, LO T67K, LY T67K, LW E67C LS E67B, LA E67B, LO E67B, LY E67B, LB E67C, LV E67C, LT E67C LW T67C LS T679, LY T679, LG T679 LS T770, LO T770, LY T770, LG T770, LP T770 LB T773, LV T773, LT T773, LW T773 LH T774 LS E675, LA E675, LY E675, LS T675 LS T776, LA T776, LO T776, LY T776, LB T776 LHGB T686 LT T68C, LB T68C - Hyper Mini TOPLED® LB M676 - Mini TOPLED Santana® LG M470 LS M47K, LO M47K, LY M47K Source: http://www.osram.convergy.de LUXEON: - LUMILED® LXK2-PW12-R00, LXK2-PW12-S00, LXK2-PW14-U00, LXK2-PW14-V00 LXK2-PM12-R00, LXK2-PM12-S00, LXK2-PM14-U00 LXK2-PE12-Q00, LXK2-PE12-R00, LXK2-PE12-S00, LXK2-PE14-T00, LXK2-PE14-U00 LXK2-PB12-K00, LXK2-PB12-L00, LXK2-PB12-M00, LXK2-PB14-N00, LXK2-PB14-P00, LXK2-PB14-Q00 LXK2-PR12-L00, LXK2-PR12-M00, LXK2-PR14-Q00, LXK2-PR14-R00 LXK2-PD12-Q00, LXK2-PD12-R00, LXK2-PD12-S00 LXK2-PH12-R00, LXK2-PH12-S00 LXK2-PL12-P00, LXK2-PL12-Q00, LXK2-PL12-R00 Source: www.luxeon.com KINGBRIGHT: KA-3528ASYC Source: www.kingbright.com
OK1 OK2 = optocoupler:PC817: SHARP OPTO COUPLER; MPN: PC817X4J000F; OC_FARNELL: 9707727; OC_NEWARK: 97K7059
Q1 = stopwatch:FOXSDLF_080-20: Crystal SMD 8.000MHz HC49S-SMD Crystal 8MHz, 30ppm, 2-Pin SMD, 11.7 x 5 x 4.5mm Source: Datasheet <http://uk.rs-online.com/web/p/products/1734329>; DESCRIPTION: Crystal SMD 8.000MHz HC49S-SMD Crystal 8MHz, 30ppm, 2-Pin SMD, 11.7 x 5 x 4.5mm; HEIGHT: mm; MANUFACTURER_NAME: Fox; MANUFACTURER_PART_NUMBER: FOXSDLF/080-20; RS_PART_NUMBER: 1734329
R1-R10 R13-R43 = rcl:R-EU_: RESISTOR, European symbol; SPICEPREFIX: R
SV1 = con-lstb:MA05-1: PIN HEADER; OC_FARNELL: unknown; OC_NEWARK: unknown
SV2 = con-lstb:MA04-2: PIN HEADER; OC_FARNELL: unknown; OC_NEWARK: unknown
SV3 = con-lstb:MA06-1: PIN HEADER; OC_FARNELL: unknown; OC_NEWARK: unknown
SV5 = con-lstb:MA04-1: PIN HEADER; OC_FARNELL: unknown; OC_NEWARK: unknown
SV6 = con-lstb:MA03-2: PIN HEADER; OC_FARNELL: unknown; OC_NEWARK: unknown
SV7 = con-lstb:MA08-1: PIN HEADER; OC_FARNELL: unknown; OC_NEWARK: unknown
U1 = stopwatch:ANALOG_DEVICES_ADG819BRTZ-500RL7: ADI-ADG819-RJ-6; CIIVA_IDS: 981692; CODE__JEDEC: MO-178-AB; COMPONENT_LINK_1_DESCRIPTION: Manufacturer URL; COMPONENT_LINK_1_URL: http://www.analog.com/en/index.html; COMPONENT_LINK_3_DESCRIPTION: Package Specification; COMPONENT_LINK_3_URL: http://www.analog.com/static/imported-files/packages/PKG_PDF/SOT-23(RJ)/RJ_6.pdf; CONFIGURATION: SPDT; DATASHEET: http://www.analog.com/static/imported-files/data_sheets/ADG819.pdf; DATASHEET_VERSION: 02-03-2012-A; FOOTPRINT_VARIANT_NAME_0: Level C; FOOTPRINT_VARIANT_NAME_1: Level B; FOOTPRINT_VARIANT_NAME_2: Level A; ID_IS_ON: 10pA, 10pA; IMPORTED: yes; IMPORTED_FROM: vault; IMPORT_TS: 1521850153; IS_OFF: 10pA, 10pA; MAX_POS_SUPPLY: 5.5V; MF: Analog Devices; MIN_POS_SUPPLY: 1.8V; MOUNTING_TECHNOLOGY: Surface Mount; MPN: ADG819BRTZ-500RL7; PACKAGE: RJ-6; PACKAGE_DESCRIPTION: 6-Pin Small Outline Transistor Package, Body 2.9 x 1.6 mm, Pitch 0.95 mm; PACKAGE_VERSION: 121608-A, 12/2008; PACKING: Reel; POWER_DISSIPATION: 5uW; PREFIX: U; RELEASE_DATE: 1391088884; RON_OHMS: 0.5; SW_FUNCTIONS: 1; VAULT_GUID: A332F1F2-24D9-455B-AD4F-0000C694F255; VAULT_REVISION: 16F06DAC-B0D8-4871-B5D1-01493EE71A7B
U2 = stopwatch:TEXAS_INSTRUMENTS_TPA6112A2DGQR: TI-TPA6112A2DGQ10-1675X1445TP; CODE__JEDEC: MO-187; COMPONENT_LINK_1_DESCRIPTION: Manufacturer URL; COMPONENT_LINK_1_URL: http://www.ti.com/; COMPONENT_LINK_3_DESCRIPTION: Package Specification; COMPONENT_LINK_3_URL: http://www.ti.com/litv/pdf/mpds043e; DATASHEET: http://www.ti.com/general/docs/lit/getliterature.tsp?genericPartNumber=TPA6112A2&fileType=pdf; DATASHEET_VERSION: SLOS342A; HEADPHONE_CHANNELS: Stereo; IMPORTED: yes; IMPORTED_FROM: vault; IMPORT_TS: 1521177440; ISDU_A: 10; LOAD_MINOHMS: 16; MF: Texas Instruments; MOUNTING_TECHNOLOGY: Surface Mount; MPN: TPA6112A2DGQR; OUTPUT_POWERW: 0.15; PACKAGE: DGQ0010D; PACKAGE_DESCRIPTION: 10-Pin Plastic Small Outline, Body 3 x 3 mm, Pitch 0.5 mm; PACKAGE_VERSION: 4073273/F, 11/2011; PREFIX: U; PSRRD_B: 83; ROHS: Yes; SUB_FAMILY: Headphone Amplifier; SUPPLY_MAXMAXVOLT: 5.5; SUPPLY_MINMINVOLT: 2.5; VAULT_GUID: 70D2BD34-084B-40BF-BB84-4C6E0342D994; VAULT_REVISION: FDDC8DA6-F7B9-4280-AF7D-FFDA60018878
U$1 = stopwatch:BLUETOOTH-RN-52: Roving Networks RN-52 Bluetooth Audio Module The RN-52 is an audio module that provides a highly integrated solution for delivering high quality stereo audio in a small form factor with little difficulty. This module is perfect for a project involving hands free audio for your car, remote controlling your media center, or streaming 2-channel audio. SparkFun Products: RN-52 - Bluetooth Audio Module <https://www.sparkfun.com/products/11678> (WRL-11678) Audio Bluetooth Breakout - RN-52 <https://www.sparkfun.com/products/12849> (WRL-12849); PROD_ID: IC-11569; SF_ID: WRL-11678
U$2 = stopwatch:SPARKFUN-RN52
U$3 = stopwatch:I2C-LEVELCONVERTER-PCB
U$4 = stopwatch:RC-STEP-DOWN
USB1 USB2 = stopwatch:MICRO-USB
V1-V4 = stopwatch:FDN337N: N-CHANNEL MOS FET; MF: FAIRCHILD SEMICONDUCTOR; MPN: FDN337N; OC_FARNELL: 9845356

## Net classes
1 +3V3: width 0.61 mm
2 +5V: width 0.61 mm
3 GND: width 0.61 mm

## Board
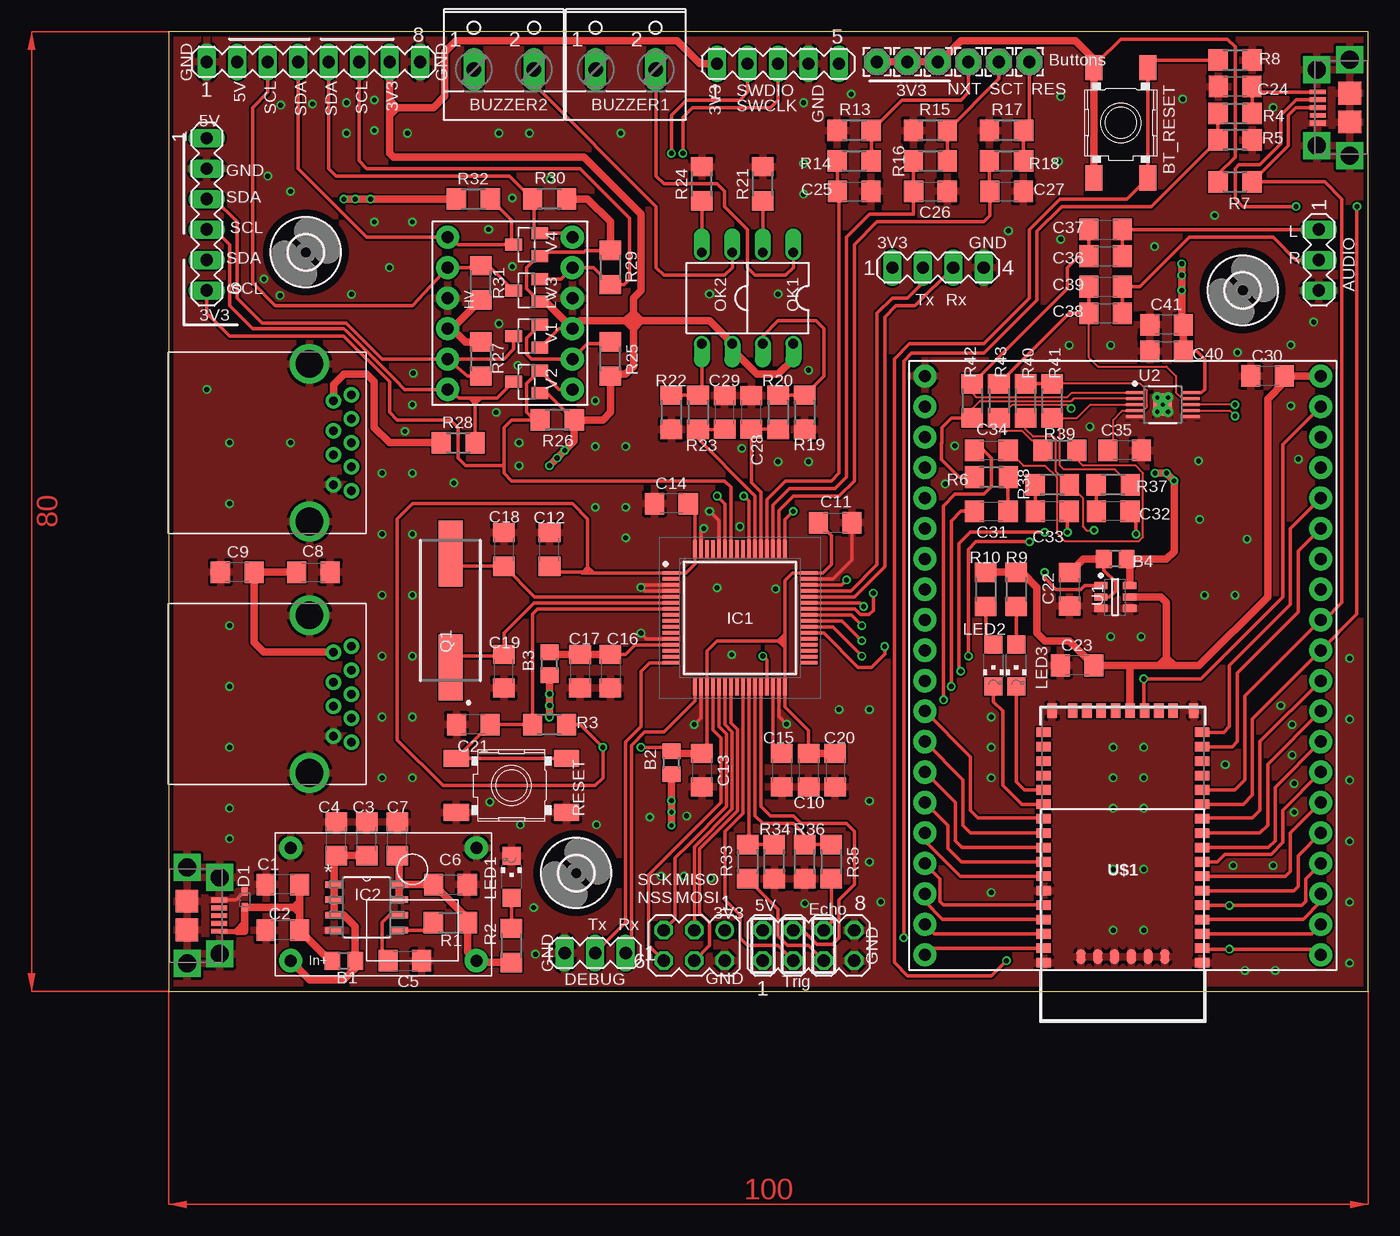
[diagram p8: board, top side]
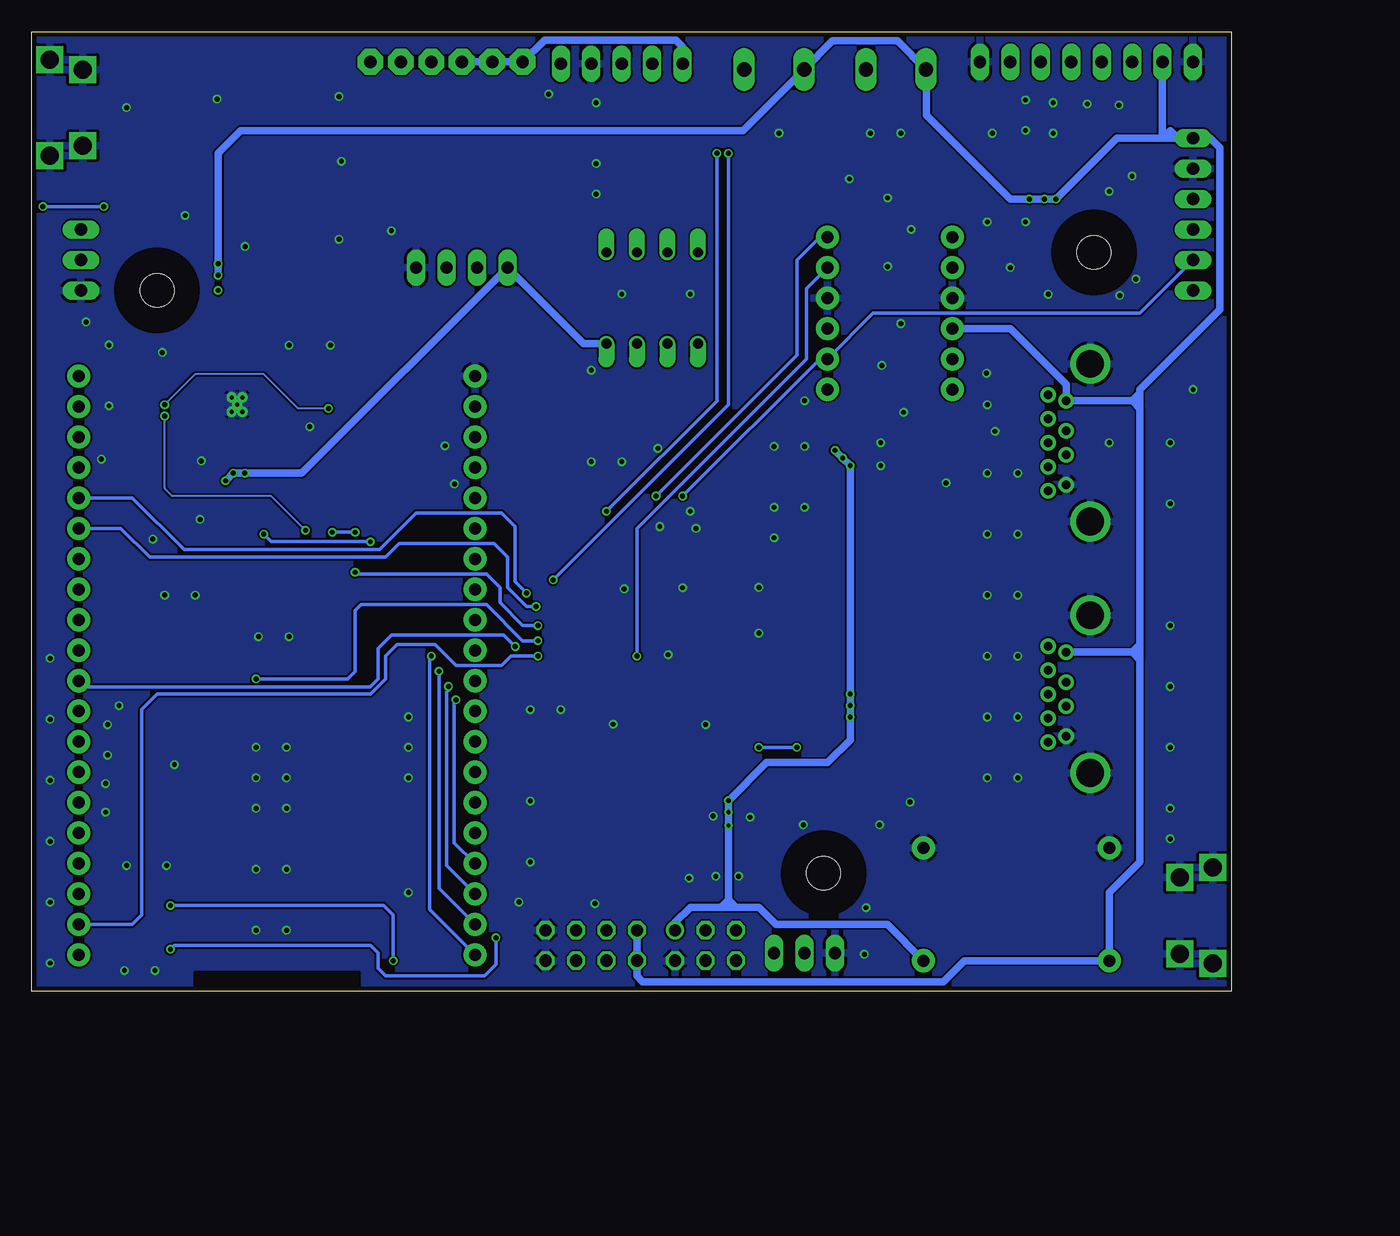
[diagram p9: board, bottom side, seen from below]

Size 100 x 80 mm. Coordinates in mm from the lower left corner, seen from the top.
Outline: 0,0 100,0 100,80 0,80 0,0
Copper layers (1*16): Top 0.035mm / dielectric 1.5mm / Bottom 0.035mm
Design rules "NOA Eagle Rule 2016-06-12": minimum track width 6mil, minimum drill 0.3mm, track to track 6mil, track to pad 6mil, pad to pad 6mil, via to via 6mil, smd to smd 0mil, copper to edge 0.4mm, drill to drill 10mil, minimum pad ring 10mil, minimum via ring 6mil, stop-mask expansion 2mil, vias tented up to drill 25mil, thermal gap 10mil
tRestrict: area 72.7,-2.5 to 86.4,1.6
bRestrict: area 72.7,-2.5 to 86.4,1.6

### Footprints (pad centres in the part's own frame; a part is rotated, then mirrored left to right if it is on the bottom)
MA03-1 = drill 1.016 long: 1 -2.54,0; 2 0,0; 3 2.54,0
L0805 = smd 1.3 x 1.5: 1 -0.95,0; 2 0.95,0
TASTER_SMD_LSG-LSH1301XX = smd 2.1 x 1.4: 1 -4.6,2.25; 2 4.6,2.25; 3 -4.6,-2.25; 4 4.6,-2.25
2,15/1,0 = drill 1.016 pad 2.159 octagon: 1 0,0
W237-102 = drill 1.194 long: 1 -2.5,-1.27; 2 2.5,-1.27
C1206 = smd 1.6 x 1.8: 1 -1.4,0; 2 1.4,0
SOD523 = smd 0.7 x 0.5: A 0.7,0; C -0.6,0
2,8 = hole 2.8: 0,0
QFP50P1200X1200X160-64N = smd 1.45 x 0.3: 1 -5.75,3.75; 2 -5.75,3.25; 3 -5.75,2.75; 4 -5.75,2.25; 5 -5.75,1.75; 6 -5.75,1.25; 7 -5.75,0.75; 8 -5.75,0.25; 9 -5.75,-0.25; 10 -5.75,-0.75; 11 -5.75,-1.25; 12 -5.75,-1.75; 13 -5.75,-2.25; 14 -5.75,-2.75; 15 -5.75,-3.25; 16 -5.75,-3.75; 33 5.75,-3.75; 34 5.75,-3.25; 35 5.75,-2.75; 36 5.75,-2.25; 37 5.75,-1.75; 38 5.75,-1.25; 39 5.75,-0.75; 40 5.75,-0.25; 41 5.75,0.25; 42 5.75,0.75; 43 5.75,1.25; 44 5.75,1.75; 45 5.75,2.25; 46 5.75,2.75; 47 5.75,3.25; 48 5.75,3.75 | smd 0.3 x 1.45: 17 -3.75,-5.75; 18 -3.25,-5.75; 19 -2.75,-5.75; 20 -2.25,-5.75; 21 -1.75,-5.75; 22 -1.25,-5.75; 23 -0.75,-5.75; 24 -0.25,-5.75; 25 0.25,-5.75; 26 0.75,-5.75; 27 1.25,-5.75; 28 1.75,-5.75; 29 2.25,-5.75; 30 2.75,-5.75; 31 3.25,-5.75; 32 3.75,-5.75; 49 3.75,5.75; 50 3.25,5.75; 51 2.75,5.75; 52 2.25,5.75; 53 1.75,5.75; 54 1.25,5.75; 55 0.75,5.75; 56 0.25,5.75; 57 -0.25,5.75; 58 -0.75,5.75; 59 -1.25,5.75; 60 -1.75,5.75; 61 -2.25,5.75; 62 -2.75,5.75; 63 -3.25,5.75; 64 -3.75,5.75
SOIC127P600X175-8N = smd 1.473 x 0.559: 1 -2.718,1.905; 2 -2.718,0.635; 3 -2.718,-0.635; 4 -2.718,-1.905; 5 2.718,-1.905; 6 2.718,-0.635; 7 2.718,0.635; 8 2.718,1.905
USB3_TYPE_A = drill 0.7 pad 1.3: 1 -3.5,-1.5; 2 -1,-1.5; 3 1,-1.5; 4 3.5,-1.5; 5 4,0; 6 2,0; 7 0,0; 8 -2,0; 9 -4,0 | drill 2.3 pad 3.3: Z1 6.57,-3.5; Z2 -6.57,-3.5
CHIPLED_1206 = smd 1.5 x 1.5: A 0,-1.75; C 0,1.75
DIL04 = drill 0.813 offset: 1 -1.27,-3.81; 2 1.27,-3.81; 3 1.27,3.81; 4 -1.27,3.81
FOXSDLF/080-20 = smd 5.5 x 2: 1 -4.75,0; 2 4.75,0
R1206 = smd 1.6 x 1.803: 1 -1.422,0; 2 1.422,0
MA05-1 = drill 1.016 long: 1 -5.08,0; 2 -2.54,0; 3 0,0; 4 2.54,0; 5 5.08,0
MA04-2 = drill 1.016 octagon: 1 -3.81,-1.27; 2 -3.81,1.27; 3 -1.27,-1.27; 4 -1.27,1.27; 5 1.27,-1.27; 6 1.27,1.27; 7 3.81,-1.27; 8 3.81,1.27
MA06-1 = drill 1.016 long: 1 -6.35,0; 2 -3.81,0; 3 -1.27,0; 4 1.27,0; 5 3.81,0; 6 6.35,0
MA04-1 = drill 1.016 long: 1 -3.81,0; 2 -1.27,0; 3 1.27,0; 4 3.81,0
MA03-2 = drill 1.016: 1 -2.54,-1.27 | drill 1.016 octagon: 2 -2.54,1.27; 3 0,-1.27; 4 0,1.27; 5 2.54,-1.27; 6 2.54,1.27
MA08-1 = drill 1.016 long: 1 -8.89,0; 2 -6.35,0; 3 -3.81,0; 4 -1.27,0; 5 1.27,0; 6 3.81,0; 7 6.35,0; 8 8.89,0
ANALOG_DEVICES_ADG819BRTZ-500RL7_1 = smd 1.1 x 0.6: 1 -1.2,0.95; 2 -1.2,0; 3 -1.2,-0.95; 4 1.2,-0.95; 5 1.2,0; 6 1.2,0.95
TEXAS_INSTRUMENTS_TPA6112A2DGQR_1 = smd 1.55 x 0.3: 1 -2.325,1; 2 -2.325,0.5; 3 -2.325,0; 4 -2.325,-0.5; 5 -2.325,-1; 6 2.325,-1; 7 2.325,-0.5; 8 2.325,0; 9 2.325,0.5; 10 2.325,1 | smd 1.57 x 1.88: 11 0,0 | drill 0.35 pad 0.5: PAD_1 -0.45,0.6; PAD_2 -0.45,-0.6; PAD_3 0.45,-0.6; PAD_4 0.45,0.6; PAD_5 0,0
RN-52 = smd 1.2 x 0.8: 1 -6.6,8.33; 2 -6.6,7.13; 3 -6.6,5.93; 4 -6.6,4.73; 5 -6.6,3.53; 6 -6.6,2.33; 7 -6.6,1.13; 8 -6.6,-0.07; 9 -6.6,-1.27; 10 -6.6,-2.47; 11 -6.6,-3.67; 12 -6.6,-4.87; 13 -6.6,-6.07; 14 -6.6,-7.27; 15 -6.6,-8.47; 16 -6.6,-9.67; 25 6.6,-9.67; 26 6.6,-8.47; 27 6.6,-7.27; 28 6.6,-6.07; 29 6.6,-4.87; 30 6.6,-3.67; 31 6.6,-2.47; 32 6.6,-1.27; 33 6.6,-0.07; 34 6.6,1.13; 35 6.6,2.33; 36 6.6,3.53; 37 6.6,4.73; 38 6.6,5.93; 39 6.6,7.13; 40 6.6,8.33; G1 -6.6,9.53; G4 6.6,9.53 | smd 0.8 x 1.2: 17 -4.2,-11.47; 18 -3,-11.47; 19 -1.8,-11.47; 20 -0.6,-11.47; 21 0.6,-11.47; 22 1.8,-11.47; 23 3,-11.47; 24 4.2,-11.47; G2 -5.9,-11.47; G3 5.9,-11.46; RFG1 -3.5,9.03; RFG2 -2.1,9.03; RFG3 -0.7,9.03; RFG4 0.7,9.03; RFG5 2.1,9.03; RFG6 3.5,9.03
SPARKFUN-RN52 = drill 1 pad 1.93: 3V3 1.27,1.27; ACI0 1.27,44.45; GND 34.29,1.27; GPIO2 1.27,46.99; GPIO3 1.27,49.53; GPIO4 1.27,41.91; GPIO5 1.27,39.37; GPIO6 1.27,6.35; GPIO7 1.27,8.89; GPIO9 1.27,26.67; GPIO10 1.27,29.21; GPIO11 1.27,31.75; GPIO12 1.27,36.83; GPIO13 1.27,34.29; LED0 34.29,26.67; LED1 34.29,24.13; M_BIAS 34.29,29.21; MIC_L+ 34.29,31.75; MIC_L- 34.29,36.83; MIC_R+ 34.29,34.29; MIC_R- 34.29,39.37; PCM_CLK 34.29,11.43; PCM_IN 34.29,3.81; PCM_OUT 34.29,6.35; PCM_SYNC 34.29,8.89; PWR_EN 1.27,3.81; SPI_CLK 34.29,19.05; SPI_MISO 34.29,16.51; SPI_MOSI 34.29,21.59; SPI_SS 34.29,13.97; SPK_L+ 34.29,49.53; SPK_L- 34.29,44.45; SPK_R+ 34.29,46.99; SPK_R- 34.29,41.91; UART_CTS 1.27,16.51; UART_RTS 1.27,19.05; UART_RX 1.27,11.43; UART_TX 1.27,13.97; USBD+ 1.27,21.59; USBD- 1.27,24.13
I2C-LEVELCONVERTER-PCB = drill 1 pad 1.93: 1 1.27,13.97; 2 1.27,11.43; 3 1.27,8.89; 4 1.27,6.35; 5 1.27,3.81; 6 1.27,1.27; 7 11.684,13.97; 8 11.684,11.43; 9 11.684,8.89; 10 11.684,6.35; 11 11.684,3.81; 12 11.684,1.27
RC-STEP-DOWN = drill 1 pad 1.93: 1 1.27,10.668; 2 1.27,1.27; 3 16.764,10.668; 4 16.764,1.27
ZX62B5PA = smd 0.4 x 1.35: D+ 0,4.125; D- 0.65,4.125; GND -1.3,4.125; ID -0.65,4.125; VBUS 1.3,4.125 | drill 1.499 pad 2.032 square: SLD1 -3.175,4.191; SLD2 3.175,4.191; SLD3 -4,1.45; SLD6 4,1.45 | smd 1.9 x 1.9: SLD4 -1.2,1.45; SLD5 1.2,1.45
SOT23 = smd 1 x 1.4: 1 -0.95,-1.1; 2 0.95,-1.1; 3 0,1.1

### Placement (x,y rotation side)
AUDIO  95.89,60.96 270 top
B1  14.61,2.54 0 top
B2  41.91,19.05 90 top
B3  31.75,27.3 90 top
B4  78.91,36.04 180 top
BT_RESET  79.38,72.39 270 top
BTN_NXT/1  61.59,77.47 0 top
BTN_RES/1  64.14,77.47 0 top
BTN_SCT/1  59.05,77.47 0 top
BUZZER1  38.1,78.11 0 top
BUZZER2  27.94,78.11 0 top
C1  9.53,8.89 180 top
C2  9.53,5.08 180 top
C3  16.51,12.7 90 top
C4  13.97,12.7 90 top
C5  19.68,2.54 0 top
C6  23.5,8.89 0 top
C7  19.05,12.7 90 top
C8  12.06,34.92 0 top
C9  5.71,34.92 180 top
C10  53.34,18.41 270 top
C11  55.56,39.05 0 top
C12  31.75,36.83 90 top
C13  44.45,18.41 270 top
C14  41.91,40.64 180 top
C15  51.12,18.41 270 top
C16  36.83,26.67 270 top
C17  34.29,26.67 270 top
C18  27.94,36.83 270 top
C19  27.94,26.67 90 top
C20  55.56,18.41 270 top
C21  25.4,22.23 180 top
C22  75.1,33.5 270 top
C23  75.73,27.15 180 top
C24  88.9,75.41 180 top
C25  57.15,66.67 0 top
C26  63.5,66.67 0 top
C27  69.85,66.67 0 top
C28  48.58,48.26 90 top
C29  46.35,48.26 90 top
C30  91.61,51.28 180 top
C31  68.58,40.01 0 top
C32  78.74,40.01 180 top
C33  73.66,40.01 180 top
C34  68.58,45.09 0 top
C35  79.69,45.09 180 top
C36  78.11,61.28 0 top
C37  78.11,63.5 0 top
C38  78.11,56.52 0 top
C39  78.11,58.74 0 top
C40  83.19,53.34 180 top
C41  83.19,55.56 180 top
D1  6.35,7.62 90 top
DEBUG  35.56,3.17 180 top
H1  11.43,61.59 0 top
H2  89.53,58.42 0 top
H3  33.97,9.84 0 top
IC1  47.62,31.11 0 top
IC2  16.51,6.99 0 top
J1  15.24,24.77 270 top
J2  15.24,45.72 270 top
LED1  28.57,9.53 0 top
LED2  68.75,27.15 180 top
LED3  70.66,27.15 180 top
NXT  66.67,77.47 0 top
OK1  50.8,57.78 180 top
OK2  45.72,57.78 180 top
Q1  23.5,31.75 90 top
R1  23.5,5.71 180 top
R2  28.57,3.81 90 top
R3  31.75,22.23 0 top
R4  88.9,73.18 180 top
R5  88.9,70.96 0 top
R6  68.58,42.86 180 top
R7  88.9,67.47 180 top
R8  88.9,77.63 180 top
R9  70.66,33.5 90 top
R10  68.11,33.5 90 top
R13  57.15,71.75 0 top
R14  57.15,69.22 180 top
R15  63.5,71.75 0 top
R16  63.5,69.22 180 top
R17  69.85,71.75 0 top
R18  69.85,69.22 180 top
R19  53.02,48.26 90 top
R20  50.8,48.26 90 top
R21  49.53,67.31 270 top
R22  41.91,48.26 90 top
R23  44.13,48.26 90 top
R24  44.45,67.31 270 top
R25  36.83,52.7 270 top
R26  32.38,47.62 0 top
R27  26.04,52.7 90 top
R28  24.13,45.72 180 top
R29  36.83,60.33 90 top
R30  31.75,66.04 0 top
R31  26.04,59.05 270 top
R32  25.4,66.04 180 top
R33  48.26,10.79 90 top
R34  50.48,10.79 270 top
R35  55.24,10.79 90 top
R36  53.02,10.79 270 top
R37  78.74,42.23 0 top
R38  73.66,42.23 0 top
R39  74.3,45.09 180 top
R40  71.44,49.21 270 top
R41  73.66,49.21 270 top
R42  66.99,49.21 90 top
R43  69.22,49.21 90 top
RES  71.75,77.47 0 top
RESET  28.57,17.14 180 top
SCT  69.22,77.47 0 top
SV1  50.8,77.31 0 top
SV2  53.34,3.81 0 top
SV3  3.17,64.77 270 top
SV5  64.14,60.33 0 top
SV6  43.81,3.81 180 top
SV7  12.06,77.47 0 top
U1  78.91,32.87 0 top
U2  82.87,48.9 0 top
U$1  79.55,11.91 180 top
U$2  97.33,52.55 180 top
U$3  34.92,64.14 180 top
U$4  8.89,1.27 0 top
USB1  0.07,6.3 270 top
USB2  99.92,73.66 90 top
V1  29.84,54.61 90 top
V2  29.84,50.8 90 top
V3  29.84,58.42 90 top
V4  29.84,62.23 90 top

### Tracks (layer width: path | path; a pad name or v marks a point on that pad's centre or on a via)
!RESET
  Top 0.305: RESET.4 24.13,19.39 | 24.13,19.39 RESET.3 | 24.13,19.39 24.13,19.55 C21.1 R3.1 30.32,31.43 30.75,31.86 IC1.7
+3V3  (via drill 0.35, 0.41)
  Top 0.305: V3.1 29.84,58.57 29.84,60.33 30.8,61.28 V4.1 31.26,61.59 34.61,61.59 34.76,61.75 R29.2 | V1.1 32.53,55.24 U$3.3 | V2.1 30.96,49.83 31.6,49.83 R26.2 | BT_RESET.3 77.31,76.99 77.47,76.83 77.47,77.47 79.38,79.38 88.27,79.38 88.9,78.74 88.9,69.53 87.48,68.1 R7.2
  Top 0.61: C7.1 19.23,11.12 IC2.8 | IC2.8 IC2.7 | IC2.8 C6.1 24.92,6.07 R1.1 24.92,3.28 U$4.4 25.81,2.39 R2.1 | V3.1 31.43,57.47 U$3.3 34.29,55.88 38.1,55.88 | R29.2 36.83,64.14 34.92,66.04 R30.2 | U1.6 80.11,35.79 B4.1 83.19,36.04 83.82,36.67 v83.82,42.55 v83.19,43.18 v82.23,43.18 | B2.1 v41.91,15.88 v41.91,14.92 v41.91,13.81 | B3.1 v31.75,24.77 v31.75,23.81 v31.75,22.86 | 38.73,55.24 38.73,52.07 38.1,51.44 36.98,51.44 R25.2 36.83,48.26 36.2,47.62 R26.2 33.81,45.87 v33.02,45.09 v32.38,44.45 v31.75,43.81 | 38.73,55.24 38.73,55.88 | 38.73,55.88 38.73,56.52 | 38.73,56.52 38.73,57.78 39.37,58.42 39.37,64.77 34.61,69.53 18.73,69.53 18.41,69.85 18.41,73.03 | 18.41,73.03 18.41,73.66 | 18.41,73.66 18.41,74.3 | 18.41,74.3 SV7.7 | OK1.4 52.07,52.7 50.8,51.44 49.05,51.44 46.99,53.5 OK2.4 45.09,55.88 39.37,55.88 | 38.1,55.88 38.73,55.88 | 39.37,55.88 38.73,55.88 | 38.1,55.88 38.73,56.52 | 38.73,56.52 39.37,55.88 | 39.37,55.88 38.73,55.24 | 38.73,55.24 38.1,55.88 | SV1.1 44.29,77.31 42.39,79.22 23.97,79.22 23.02,78.26 23.02,74.61 22.07,73.66 19.05,73.66 | 19.05,73.66 18.41,73.66 | 19.05,73.66 18.41,74.3 | 19.05,73.66 18.41,73.03 | 77.31,76.99 77.31,77.47 75.56,79.22 66.04,79.22 64.29,77.47 BTN_RES/1.1 BTN_NXT/1.1 BTN_SCT/1.1 | BT_RESET.3 BT_RESET.4
  Bottom 0.61: U$4.4 28.67,5.56 37.94,5.56 39.37,6.99 41.27,6.99 | SV6.1 46.35,5.71 45.09,6.99 42.55,6.99 | 41.27,6.99 41.91,6.99 | 41.91,6.99 42.55,6.99 | 41.91,7.62 v41.91,13.81 v41.91,14.92 v41.91,15.88 38.73,19.05 33.66,19.05 31.75,20.95 v31.75,22.86 v31.75,23.81 v31.75,24.77 v31.75,43.81 v32.38,44.45 v33.02,45.09 | 41.91,7.62 41.91,6.99 | 41.91,7.62 41.27,6.99 | 41.91,7.62 42.55,6.99 | SV1.1 45.72,78.74 46.27,79.3 57.23,79.3 BTN_SCT/1.1 BTN_NXT/1.1 BTN_RES/1.1 | OK1.4 53.98,53.98 SV5.1 77.47,43.18 v82.23,43.18 v83.19,43.18 v83.82,42.55
+5V  (via drill 0.41)
  Top 0.305: U2.10 86.09,49.9 86.36,50.16 86.36,52.7 85.72,53.34 C40.1
  Top 0.61: C3.1 C4.1 13.79,11.12 IC2.1 IC2.2 IC2.3 14.61,6.35 15.55,5.4 B1.2 15.55,1.91 15.56,1.91 14.61,0.95 11.75,0.95 U$4.2 | R31.2 23.65,55.24 | 23.65,55.24 U$3.9 | R27.2 24.77,54.13 23.65,55.24 | C40.1 C41.1 84.45,55.69 v84.45,58.42 v84.45,59.69 v84.45,60.64 | J2.1 13.74,50.55 14.61,51.42 14.61,51.44 16.51,51.44 17.14,50.8 17.14,46.99 18.41,45.72 R28.2 | C8.1 C9.1 7.12,29.08 7.93,28.27 J1.1 | R32.2 v16.83,66.04 v15.56,66.04 v14.61,66.04
  Bottom 0.61: 7.62,48.59 7.62,28.9 | 7.62,28.9 7.62,28.26 | 7.62,28.26 7.62,27.63 | 7.62,48.59 7.62,49.21 | 7.62,49.21 7.62,49.85 | J1.1 8.26,28.27 | 8.26,28.27 7.63,28.27 7.62,28.26 | 8.26,28.27 7.62,28.9 | 8.26,28.27 7.62,27.63 | 8.26,49.22 J2.1 13.74,50.57 18.41,55.24 U$3.9 | 8.26,49.22 7.63,49.22 7.62,49.21 | 8.26,49.22 7.62,48.59 | 8.26,49.22 7.62,49.85 | 7.62,49.85 7.62,50.16 0.95,56.83 0.95,70.33 1.75,71.12 SV3.1 | SV3.1 4.45,71.12 5.08,71.75 5.71,71.12 | 5.71,71.12 SV7.2 | SV2.2 SV2.1 49.53,1.27 49.05,0.79 23.97,0.79 22.23,2.54 U$4.2 10.16,8.26 7.62,10.79 7.62,27.63 | 5.71,71.12 9.53,71.12 v14.61,66.04 v15.56,66.04 v16.83,66.04 18.41,66.04 25.4,73.03 25.4,76.8 BUZZER2.1 27.82,79.22 33.22,79.22 BUZZER1.1 40.68,71.75 82.55,71.75 84.45,69.85 v84.45,59.69 | 5.71,71.12 SV3.1
BT_ACI0
  Top 0.305: U$2.ACI0 96.06,7.46 94.57,5.98 U$1.3
BT_LED0
  Top 0.305: U$1.30 71.12,15.58 69.56,17.14 69.53,17.14 69.53,23.35 68.75,24.13 LED2.C
BT_LED1
  Top 0.305: LED3.C 70.66,19.05 70.66,18.84 70.66,17.45 71.33,16.78 U$1.29
BT_MIC_BIAS
  Top 0.305: U$1.31 72.88,14.45 67.48,14.45 66.84,15.09 66.84,19.53 U$2.M_BIAS
BT_MIC_L+
  Top 0.305: U$2.MIC_L+ 66.21,17.62 66.21,13.81 66.84,13.18 U$1.32
BT_MIC_L-
  Top 0.305: U$1.34 66.07,10.78 64.94,11.91 64.94,13.81 U$2.MIC_L-
BT_MIC_R+
  Top 0.305: U$1.33 66.14,11.98 65.58,12.54 65.58,15.72 U$2.MIC_R+
BT_MIC_R-
  Top 0.305: U$1.35 66,9.58 63.03,12.54 U$2.MIC_R-
BT_NEXT
  Top 0.305: U$1.6 93.09,9.58 93.52,10.01 93.52,13.18 U$2.GPIO12
BT_PIO3  (via drill 0.41)
  Top 0.305: R4.2 R5.1 81.92,65.41 74.45,65.41 72.39,63.34 72.39,57.63 67.94,53.18 61.91,53.18 61.28,52.55 v61.28,4.45 | U$1.1 86.23,3.49 v88.42,3.49 95.58,3.49 U$2.GPIO3
  Bottom 0.305: v61.28,4.45 61.28,2.22 62.23,1.27 70.48,1.27 71.12,1.91 71.12,3.17 71.75,3.81 88.11,3.81 v88.42,3.49
BT_PIO4  (via drill 0.41)
  Top 0.305: U$2.GPIO4 94.78,9.37 94.78,7.46 94.46,7.14 v88.42,7.14 86.18,7.14 U$1.4 | R8.2 82.26,77.62 BT_RESET.1 BT_RESET.2 79.88,66.04 74.3,66.04 71.75,63.5 71.75,57.78 67.94,53.98 61.75,53.98 60.48,52.7 60.48,2.38 61.59,1.27 68.58,1.27 v69.85,2.54
  Bottom 0.305: v88.42,7.14 70.64,7.14 69.85,6.35 v69.85,2.54
BT_PLAY
  Top 0.305: U$2.GPIO13 92.88,15.09 92.88,12.39 91.91,11.41 88.05,11.41 87.42,10.78 U$1.7
BT_PREV
  Top 0.305: U$1.8 91.68,11.98 92.25,12.54 92.25,16.99 U$2.GPIO11
BT_SPK_L+  (via drill 0.41)
  Top 0.305: U$1.40 63.59,3.58 U$2.SPK_L+ | v80.64,38.1 80.64,39.5 C32.1 | v66.67,27.94 66.67,36.83 67.31,37.47 v71.75,37.47
  Bottom 0.305: U$2.SPK_L+ 66.83,6.82 66.83,27.78 v66.67,27.94 | v80.64,38.1 80.01,37.47 v71.75,37.47
BT_SPK_L-  (via drill 0.41)
  Top 0.305: U$1.38 64.52,5.98 63.03,7.46 U$2.SPK_L- | v65.25,25.4 65.25,39.21 66.04,40.01 C31.1
  Bottom 0.305: U$2.SPK_L- 65.41,10.47 65.41,24.92 65.25,25.08 v65.25,25.4
BT_SPK_R+  (via drill 0.41)
  Top 0.305: U$1.39 63.81,4.78 U$2.SPK_R+ | v74.93,38.26 74.93,39.88 C33.1 | v66.04,26.67 65.88,26.83 65.88,37.31 66.83,38.26 v73.03,38.26
  Bottom 0.305: U$2.SPK_R+ 66.04,8.56 v66.04,26.67 | v73.03,38.26 v74.93,38.26
BT_SPK_R-  (via drill 0.41)
  Top 0.152: C34.1 66.99,45.09
  Top 0.305: U$1.37 64.59,7.18 64.31,7.46 64.31,9.37 U$2.SPK_R- | 66.99,45.09 67.94,45.09 68.58,44.45 68.58,42.07 67.94,41.43 65.56,41.43 64.59,40.46 64.59,24.31 v64.61,24.29
  Bottom 0.305: U$2.SPK_R- 64.77,12.38 64.77,24.13 v64.61,24.29
BT_USBD+
  Top 0.305: U$1.12 88.86,16.78 89.7,17.62 89.7,24.61 96.05,30.95 | 96.05,30.95 U$2.USBD+ | USB2.D+ 93.98,73.66 93.34,73.03 93.34,70.48 R7.1 96.36,67.47 97.79,66.04 97.79,32.38 96.36,30.95 96.05,30.95
BT_USBD-  (via drill 0.41)
  Top 0.305: U$1.11 89.56,15.58 90.34,16.36 90.34,22.7 U$2.USBD- 99.06,31.43 v99.06,65.41 | v93.98,65.41 89.53,65.41 88.9,66.04 88.9,68.58 89.22,68.9 90.96,68.9 92.71,70.64 92.71,73.04 93.98,74.31 USB2.D-
  Bottom 0.305: v93.98,65.41 v99.06,65.41
BT_VCC
  Top 0.61: U$1.20 80.14,27.15 | 80.14,27.15 82.55,27.15 | 82.55,27.15 83.19,27.15 | 83.19,27.15 83.82,27.15 | 83.82,27.15 85.89,27.15 91.61,32.87 91.61,49.38 93.01,50.77 C30.1 U$2.3V3 | 80.14,27.15 C23.1 75.08,29.21 73.03,29.21 72.39,29.84 72.39,33.66 71.12,34.92 R9.2 R10.2 | U1.5 82.7,32.87 83.19,32.38 83.19,27.94 | 83.19,27.94 83.19,27.15 | 83.19,27.94 | 83.19,27.94 83.19,27.79 | 83.19,27.79 82.55,27.15 | 83.19,27.94 83.19,27.79 | 83.19,27.79 83.82,27.15
BT_VOL_DOWN
  Top 0.305: U$1.9 90.97,13.18 91.61,13.81 91.61,18.89 U$2.GPIO10
BT_VOL_UP
  Top 0.305: U$1.5 93.8,8.38 94.15,8.73 94.15,11.28 U$2.GPIO5
GND  (via drill 0.41)
  Top 0.305: IC1.3 39.58,33.87 v39.37,33.66 39.66,33.37 IC1.4 | IC1.12 39.85,29.36 v39.37,29.84 | IC1.18 44.38,22.79 v43.81,22.23 | IC1.63 44.38,38.34 v44.61,38.58 | IC1.60 45.88,39.22 v45.09,40.01 | C11.2 56.96,35.93 55.4,34.37 IC1.47 | IC1.31 50.88,22.89 v51.51,22.25 | D1.A 5.63,7.6 USB1.GND | U2.PAD_5 82.42,48.45 U2.PAD_2
  other vias: 92.08,73.66 17.78,17.78 20.32,17.78 20.32,22.86 17.78,22.86 20.32,27.94 17.78,27.94 20.32,33.02 17.78,33.02 20.32,38.1 17.78,38.1 17.78,43.18 20.32,43.18 10.16,45.72 5.08,45.72 5.08,40.64 5.08,30.48 5.08,25.4 5.08,20.32 5.08,15.24 5.08,12.7 43.18,14.61 78.74,20.32 81.28,20.32 78.74,17.78 81.28,17.78 81.28,15.24 78.74,15.24 78.74,10.16 81.28,10.16 81.28,5.08 78.74,5.08 68.58,22.86 68.58,20.32 68.58,17.78 68.58,8.23 88.09,18.9 89.71,1.73 92.25,1.73 58.42,23.47 58.42,15.85 58.42,10.77 53.04,7.32 55.88,23.47 40.11,14.5 30.58,3.07 35.66,13.87 26.77,15.77 29.31,13.87 30.43,6.96 45.72,33.63 50.6,33.53 46.94,28.04 38.1,37.8 38.1,40.34 38.1,45.42 35.56,45.42 35.56,40.34 23.77,42.37 7.94,59.37 15.24,58.1 18.41,60.33 9.29,57.99 9.35,73.86 11.99,73.96 14.83,74.07 14.83,71.53 19.91,71.53 27.53,71.53 30.07,71.53 37.69,71.53 52.93,68.99 52.93,66.45 52.93,74.07 56.9,74.78 74.37,74.57 74.17,69.19 70,63.4 84.53,74.37 87.2,64.67 89.1,53.24 93.55,53.87 82.19,62.08 74.37,62.69 78.54,53.85 75.08,53.85 86.36,33.02 88.9,33.02 85.95,39.32 85.85,44.2 81.08,29.57 78.54,29.57 98.45,27.74 98.45,22.66 98.45,17.58 98.45,12.5 98.45,7.42 98.45,2.34 41.06,9.58 42.96,9.58 95.45,55.78 45.19,9.42 59.37,7.44 17.14,64.14 20.32,64.14 26.67,63.5 27.3,48.26 20.32,48.9 19.68,46.67 29.21,45.72 29.21,43.81 93.55,48.79 94.18,44.35 89.9,37.68 17.14,74.3 17.14,71.75 88.74,10.48 92.08,10.48 93.82,17.3 93.66,19.68 93.66,22.23 92.71,23.81 93.82,14.92 76.8,47.05 65.53,45.47 64.74,42.29 50.8,44.15 53.34,44.15 3.17,50.16 47.62,38.73 47.78,45.26 45.09,58.12 50.8,58.12 8.26,67.94 10.16,66.67 53.34,51.77 31.82,67.72 28.64,66.13 28.64,60.41 29.12,52.16 27.53,55.65 35.56,49.23 20.39,51.52
  pour Top: 73.03,23.5 86.36,23.5 86.36,1.91 73.03,1.91
  pour Bottom: 79.38,50.8 79.38,46.99 86.36,46.99 86.36,50.8
  pour Top: 0,80.01 0,0 100.33,0 100.33,0.64 100.33,80.01
  pour Bottom: -0.64,80.64 -0.64,0 100.33,0 100.33,80.64
I2C_SCL_5V
  Top 0.305: V3.3 26.69,60.48 R31.1 25.88,60.33 U$3.11 20.32,57.15 8.89,57.15 6.99,59.05 6.99,73.66 8.26,74.93 SV7.3
I2C_SDA_5V
  Top 0.305: R32.1 28.57,64.29 28.57,62.4 V4.3 24.13,62.23 U$3.12 16.51,62.87 10.79,68.58 SV7.4
LCD_I2C_SCL_5V
  Top 0.305: V2.3 27.39,49.45 26.04,49.45 | 25.07,49.45 25.56,49.45 | 25.56,49.45 26.04,49.45 | 25.56,49.45 25.55,49.44 25.55,48.96 | R28.1 25.55,48.9 25.55,48.96 | 25.55,48.96 26.04,49.45 | 25.55,48.96 25.07,49.45 | 25.07,49.45 24.77,49.45 24.21,49.45 U$3.7 19.68,50.16 18.87,50.98 18.87,50.99 14.79,55.07 14.78,55.07 14.61,55.24 6.99,55.24 5.08,57.15 5.08,62.23 3.81,63.5 SV3.4
LCD_I2C_SDA_5V
  Top 0.305: U$3.8 26.04,52.7 27.94,52.7 28.75,53.51 V1.3 | R27.1 24.92,51.28 U$3.8 | U$3.8 17.8,52.7 14.81,55.7 14.45,55.7 7.8,55.7 5.71,57.78 5.71,64.14 3.81,66.04 SV3.3
MCU_BT_!CMD_MODE  (via drill 0.41)
  Top 0.305: U$1.10 86.22,14.45 90.34,14.45 90.97,15.09 90.97,20.8 U$2.GPIO9 | IC1.38 53.4,29.84 54.61,29.84 57.47,26.99 58.58,26.99 59.69,28.1 v59.69,28.73
  Bottom 0.305: v59.69,28.73 60.65,29.69 70,29.69 71.12,28.57 71.12,26.04 71.78,25.38 95.55,25.38 U$2.GPIO9
MCU_BT_ENABLE  (via drill 0.41)
  Top 0.305: U1.1 76.36,33.81 76.04,33.5 73.98,33.5 73.03,34.45 v73.03,34.92 | IC1.41 56.9,31.36 v57.78,30.48
  Bottom 0.305: v57.78,30.48 59.05,30.48 60.96,32.38 60.96,33.66 62.08,34.77 63.56,34.77 72.87,34.77 v73.03,34.92
MCU_BT_INT  (via drill 0.41)
  Top 0.305: U$1.2 95.28,4.78 U$2.GPIO2 | IC1.39 55.36,30.36 v57.78,27.94
  Bottom 0.305: v57.78,27.94 60.03,27.94 60.82,27.15 64.61,27.15 66.36,28.89 69.53,28.89 70.48,27.94 70.48,26.02 71.74,24.77 89.53,24.77 90.81,23.5 90.81,6.35 91.59,5.56 U$2.GPIO2
MCU_BT_PWR_EN  (via drill 0.41)
  Top 0.305: U$2.PWR_EN 92.88,45.56 92.88,32.87 87.8,27.79 86.05,26.04 v81.28,26.04 81.28,25.4 81.28,23.45 U$1.19 | IC1.40 56.13,30.86 v57.78,29.21
  Bottom 0.305: v57.78,29.21 59.05,29.21 62.08,32.23 72.55,32.23 73.03,31.75 73.03,26.67 73.66,26.04 v81.28,26.04
MCU_BT_RX  (via drill 0.41)
  Top 0.305: U$1.16 87.94,21.58 88.44,22.07 88.44,27.15 93.52,32.23 93.52,38.58 U$2.UART_RX | v58.74,33.18 58.74,31.75 58.4,31.41 57.65,31.41 57.19,31.86 IC1.42
  Bottom 0.305: U$2.UART_RX 91.6,41.12 87.29,36.8 70.99,36.8 67.94,39.85 63.56,39.85 60.8,39.85 59.69,38.73 59.69,34.13 v58.74,33.18
MCU_BT_TX  (via drill 0.41)
  Top 0.305: U$1.15 88.65,20.38 89.07,20.8 89.07,26.52 94.15,31.59 94.15,36.67 U$2.UART_TX | v57.94,32.07 57.65,32.37 IC1.43
  Bottom 0.305: v57.94,32.07 58.74,32.07 60.33,33.66 60.33,36.2 61.44,37.31 63.56,37.31 69.37,37.31 70.48,36.2 73.34,36.2 90.17,36.2 92.55,38.58 U$2.UART_TX
MCU_BUTTON_NEXT
  Top 0.305: IC1.52 49.88,40.98 51.44,42.55 55.24,42.55 55.88,43.18 55.88,66.55 C25.1 55.75,69.19 R14.2
MCU_BUTTON_RES
  Top 0.305: IC1.50 50.88,40.08 52.07,41.27 55.88,41.27 57.15,42.55 57.15,62.23 59.05,64.14 67.94,64.14 68.45,64.64 C27.1 68.43,66.7 R18.2
MCU_BUTTON_SELECT
  Top 0.305: IC1.51 50.38,40.53 51.75,41.91 55.56,41.91 56.52,42.86 56.52,62.87 58.42,64.77 62.1,64.77 C26.1 62.1,69.19 R16.2
MCU_BUZZER1
  Top 0.305: 50.78,46.86 R20.1 50.78,46.86 | IC1.53 49.38,41.59 48.58,42.39 C28.1 50.78,46.86
MCU_BUZZER2
  Top 0.305: IC1.54 48.88,41.3 43.81,46.35 43.81,46.52 R23.1 46.33,46.84 C29.1
MCU_DEBUG_RX
  Top 0.305: IC1.17 43.88,24.19 41.27,21.59 39.69,21.59 38.58,20.48 38.58,3.65 DEBUG.1
MCU_DEBUG_TX
  Top 0.305: IC1.16 40.06,27.36 39.37,26.67 39.37,22.07 38.1,20.8 38.1,5.71 DEBUG.2
MCU_I2C2_SCL  (via drill 0.41)
  Top 0.305: V3.2 32.7,59.37 U$3.5 35.41,60.33 R29.1 37.95,58.9 38.42,59.37 38.42,64.45 34.29,68.58 16.51,68.58 15.88,69.22 SV7.6 | IC1.29 49.88,27.59 v49.53,27.94
  Bottom 0.305: v49.53,27.94 49.53,38.58 35.4,52.7 35.4,58.58 U$3.5
MCU_I2C2_SDA  (via drill 0.41)
  Top 0.305: U$3.6 33.34,63.18 V4.2 30.48,63.65 30.48,66.04 R30.1 28.42,67.94 13.97,67.94 13.34,68.58 SV7.5 | v47.94,41.27 48.38,40.84 IC1.55
  Bottom 0.305: v47.94,41.27 36.2,53.02 36.2,60.96 34.29,62.87 U$3.6
MCU_LCD_I2C_SCL
  Top 0.305: U$3.1 32.53,50.16 V2.2 29.84,50.65 29.84,48.26 30.48,47.62 | 30.48,47.62 R26.1 | 27.94,43.81 24.77,43.81 24.13,44.45 24.13,46.99 23.5,47.62 19.05,47.62 18.41,48.26 18.41,50.8 14.61,54.61 5.08,54.61 3.17,56.52 SV3.6 | IC1.58 46.88,42.02 46.35,42.55 28.57,42.55 27.94,43.18 | 27.94,43.18 27.94,43.81 | 27.94,43.18 | R26.1 28.57,47.62 27.94,46.99 27.94,43.81 | 30.48,47.62 R26.1
MCU_LCD_I2C_SDA  (via drill 0.41)
  Top 0.305: V1.2 29.84,54.46 29.84,53.13 30.27,52.7 U$3.2 34.92,53.98 36.68,53.98 R25.1 | IC1.59 46.38,40.62 v45.72,41.27
  Bottom 0.305: SV3.5 7.62,56.52 29.84,56.52 U$3.2 34.29,52.7 v45.72,41.27
MCU_SONIC1_ECHO
  Top 0.305: IC1.26 48.38,12.33 R33.2 R34.1
MCU_SONIC1_TRIG
  Top 0.305: IC1.25 47.88,22.01 47.88,22 47.88,14.82 46.38,13.31 46.38,7.6 47.62,6.35 47.62,4.45 48.26,3.81 50.8,3.81 SV2.3
MCU_SONIC2_ECHO
  Top 0.305: IC1.27 48.88,14.62 49.53,13.97 52.07,13.97 53.02,13.02 R36.1 R35.2
MCU_SONIC2_TRIG
  Top 0.305: SV2.4 52.86,5.08 54.05,3.89 55.32,3.89 55.88,4.45 55.88,7.62 57.15,8.89 57.15,13.34 56.52,13.97 52.72,13.97 52.08,14.61 50.16,14.61 49.38,15.39 IC1.28
MCU_SPI_MISO
  Top 0.305: IC1.22 46.38,22.22 46.97,21.62 46.97,15.2 43.81,12.04 SV6.3
MCU_SPI_MOSI
  Top 0.305: IC1.23 46.88,22.36 47.43,21.81 47.43,15.01 44.27,11.85 44.27,6.53 45.09,5.71 45.09,3.81 SV6.4
MCU_SPI_NSS
  Top 0.305: IC1.20 45.38,21.78 46.04,21.11 46.04,15.72 43.18,12.86 40.01,9.68 40.01,3.81 SV6.6
MCU_SPI_SCK
  Top 0.305: IC1.21 45.88,22.07 46.51,21.43 46.51,15.39 43.37,12.24 43.36,12.24 42.23,11.11 42.23,6.03 SV6.5
MCU_SWCLK  (via drill 0.41)
  Top 0.305: IC1.49 51.38,39.31 v52.07,40.01 | SV1.3 50.8,74.3 50.16,73.66 43.66,73.66 42.86,72.87 v42.86,69.85
  Bottom 0.305: v52.07,40.01 42.86,49.21 v42.86,69.85
MCU_SWDIO  (via drill 0.41)
  Top 0.305: IC1.46 56.09,33.87 v56.52,34.29 | v41.91,69.85 41.91,73.03 43.18,74.3 47.62,74.3 48.26,74.93 SV1.2
  Bottom 0.305: v56.52,34.29 41.91,48.9 v41.91,69.85
MCU_UART_RX
  Top 0.305: IC1.45 56.86,33.37 59.05,35.56 59.05,56.52 60.33,57.78 61.59,57.78 62.87,59.05 SV5.2
MCU_UART_TX
  Top 0.305: SV5.3 62.23,57.15 60.64,57.15 59.69,56.2 59.69,35.41 57.15,32.87 IC1.44
N$1
  Top 0.305: C2.1 11.12,5.08 10.93,5.27
  Top 0.406: USB1.VBUS 5.71,5
  Top 0.61: 10.48,6.99 6.38,6.99 D1.C 6.35,6.03 6.35,5.71 | 10.48,6.99 10.93,6.99 | 10.93,6.99 10.93,7.62 | 10.93,7.62 C1.1 | 10.93,6.99 10.93,6.35 | 10.93,6.35 10.93,5.27 | 10.48,6.99 10.93,6.54 10.93,6.35 | 10.48,6.99 10.93,7.43 10.93,7.62 | 6.35,5.71 6.35,5 5.71,5 6.35,5.64 6.35,5.71 | C2.1 13.46,2.54 B1.1
N$2
  Top 0.305: IC2.6 18.41,6.35 17.78,5.71 17.78,3.04 C5.1
N$3
  Top 0.305: C15.1 50.38,20.56 IC1.30
N$4
  Top 0.305: U1.2 78.43,32.87 78.9,33.34 78.9,34.13 77.96,35.07 B4.2
  Top 0.61: B4.2 76.24,36.04 C22.1
N$5
  Top 0.305: IC2.5 22.23,5.08 22.23,5.56 R1.2
N$6
  Top 0.305: LED1.A R2.2
N$7
  Top 0.305: C24.1 90.31,75.42 90.49,75.25 | USB2.VBUS 90.78,74.96 90.49,75.25 | R4.1 90.32,75.08 90.49,75.25
N$9
  Top 0.305: R14.1 R13.2 61.11,74.3 66.04,74.3 66.67,74.93 NXT.1
N$10
  Top 0.305: R16.1 R15.2 69.22,76.05 SCT.1
N$11
  Top 0.305: R10.1 68.11,29.54 LED2.A
N$12
  Top 0.152: R42.1 66.99,48.58 67.63,49.21 75.25,49.21 75.43,49.4 U2.2
  Top 0.305: R42.1 65.25,47.79 64.45,46.99 64.45,45.7 64.43,45.68 64.43,44.32 65.89,42.86 R6.2
N$13
  Top 0.305: R9.1 LED3.A
N$14
  Top 0.305: R18.1 R17.2 71.75,72.24 RES.1
N$15
  Top 0.305: OK1.1 52.07,60.33 51.44,59.69 48.9,59.69 48.26,60.33 48.26,63.5 46.35,65.41 46.35,66.67 45.72,67.31 41.27,67.31 40.64,67.94 40.64,76.8 BUZZER1.2
N$16
  Top 0.305: OK1.2 R21.2
N$17
  Top 0.305: OK1.3 49.53,54.61 50.8,55.88 53.98,55.88 54.61,55.24 54.61,51.27 R19.2 R20.2
N$18
  Top 0.305: BUZZER2.2 30.44,75.61 40.64,65.41 40.64,61.59 40.64,60.33 41.27,59.69 46.35,59.69 46.99,60.33 OK2.1
N$19
  Top 0.305: R24.2 OK2.2
N$20
  Top 0.305: R22.2 R23.2 44.45,50 OK2.3
N$21
  Top 0.305: R35.1 55.24,5.71 SV2.6
N$22
  Top 0.305: R33.1 50.8,6.83 50.8,4.6 51.59,3.81 53.34,3.81 SV2.5
N$23  (via drill 0.41)
  Top 0.152: R39.2 72.05,45.91 71.95,45.91 71.18,46.67 69.53,46.67 69.22,46.99 R43.1 70.32,48.9 74.93,48.9 v75.25,48.58 | v88.9,48.9 U2.8
  Bottom 0.152: v75.25,48.58 77.79,48.58 80.64,51.44 86.36,51.44 v88.9,48.9
N$25
  Top 0.305: C38.2 C39.2 80.96,58.74 85.09,62.87 92.08,62.87 93.98,60.96 AUDIO.2
N$26
  Top 0.152: C38.1 76.7,52.84 77.47,52.07 83.19,52.07 83.98,51.28 83.98,49.92 84.5,49.4 U2.9
  Top 0.305: C39.1 C38.1 75.1,56.52 R43.2
N$27
  Top 0.152: R42.2 66.99,49.85 67.31,49.53 74.93,49.53 75.3,49.9 75.56,49.9 U2.1
  Top 0.305: C37.1 C36.1 75.88,61.28 74.93,60.33 74.93,58.57 R42.2
N$30
  Top 0.305: C31.2 69.98,42.84 R6.1
N$31
  Top 0.305: C32.2 77.34,42.21 R37.1
N$32
  Top 0.305: C33.2 72.26,42.21 R38.1
N$33
  Top 0.152: C34.2 71.25,43.81 73.06,43.81 74.03,42.85 74.03,38.17 74.69,37.52 80.89,37.52 81.23,37.86 81.23,43.19 80.61,43.8 76.21,43.8 75.72,44.3 R39.1
N$34
  Top 0.152: R41.2 74.3,47.79 | 74.3,47.79 75.73,47.79 76.83,48.9 U2.3 | R37.2 78.89,43.5 74.61,43.5 74.3,43.81 74.3,47.79
N$35  (via drill 0.41)
  Top 0.152: R40.2 71.44,46.85 72.07,46.22 73.77,46.22 73.98,46.01 73.98,43.33 R38.2 76.2,41.11 76.2,38.73 76.52,38.42 v77.15,38.42 | U2.7 88.45,48.4 v88.9,47.94
  Bottom 0.152: v77.15,38.42 80.01,41.27 88.27,41.27 88.9,41.91 v88.9,47.94
N$36
  Top 0.152: C35.2 78.74,45.53 78.74,47.62 79.38,48.26 | 79.38,48.26 79.51,48.4 | 81.55,48.71 81.55,48.9 | 81.55,48.9 81.55,50.08 80.99,50.63 R41.1 | 79.38,48.26 79.51,48.4 | 79.51,48.4 U2.4 81.23,48.4 81.55,48.71 | 81.55,48.9 81.55,48.71
  Top 0.305: R40.1 R41.1
N$37
  Top 0.305: C36.2 C37.2 81.28,63.5 AUDIO.1
OSC_IN
  Top 0.305: IC1.5 30.5,32.87 C18.2 23.62,35.43 23.5,35.56 Q1.2
OSC_OUT
  Top 0.305: IC1.6 30.46,32.37 27.94,29.84 C19.2 27.81,27.94 23.5,27.94 Q1.1
VDD  (via drill 0.41)
  Top 0.305: C13.1 44.88,20.24 IC1.19 44.88,28.36 45.72,29.21 50.8,29.21 | 35.36,34.87 IC1.1 43.12,34.87 43.88,35.62 IC1.64 43.88,40.58 43.81,40.64 C14.1 | 35.36,34.87 34.92,34.87 | 34.92,34.87 34.44,34.87 | B2.2 41.59,20.32 v39.37,20.32 | R3.2 34.29,22.23 v36.2,20.32 36.2,17.78 35.56,17.14 22.86,17.14 19.05,20.95 19.05,39.37 20.32,40.64 33.66,40.64 34.92,39.37 34.92,35.36 | C11.1 55.24,37.97 55.24,35.56 54.55,34.87 IC1.48 52.01,34.87 51.38,34.23 51.38,29.69 | C10.1 53.34,21.72 51.38,23.68 IC1.32 51.38,28.64 | 51.38,29.69 51.38,29.21 | 51.38,29.21 51.38,28.64 | 50.8,29.21 51.38,29.21 | 50.8,29.21 51.12,28.89 | 51.12,28.89 51.38,28.64 | 50.8,29.21 51.12,29.53 | 51.12,29.53 51.28,29.69 51.38,29.69 | 51.12,29.53 51.12,28.89 | 34.92,35.35 34.92,34.87 | 34.44,34.87 34.92,35.35 | 34.92,35.35 34.92,35.36 | 34.92,35.36 35.36,34.92 35.36,34.87 | 34.44,34.87 34.38,34.92 32.26,34.92 C12.1
  Top 0.61: B2.2 42.09,19.82 C13.1 | C20.1 C10.1
  Bottom 0.305: v36.2,20.32 v39.37,20.32
VDDA
  Top 0.305: IC1.13 38.87,28.86 38.07,28.07 C16.1
  Top 0.61: B3.2 31.93,28.07 C17.1 C16.1
(copper drawn outside any net)
  shapes: Top area x2

### Text on the board
tNames: GND | GND | Buttons | 5V | SCL | SDA | SDA | SCL | 3V3 | SWDIO | 3V3 | 3V3 | SWCLK | 5V | GND | GND | SDA | SCL | L | 3V3 | GND | SDA | R | SCL | Tx | Rx | 3V3 | SCK / NSS | MISO / MOSI | 5V | 3V3 | Echo | Tx | Rx | GND | GND | GND | Trig